# EasyEDA Pro project ProPrj_STM32电赛单片机开发板_2026-03-28.epro, board PCB1
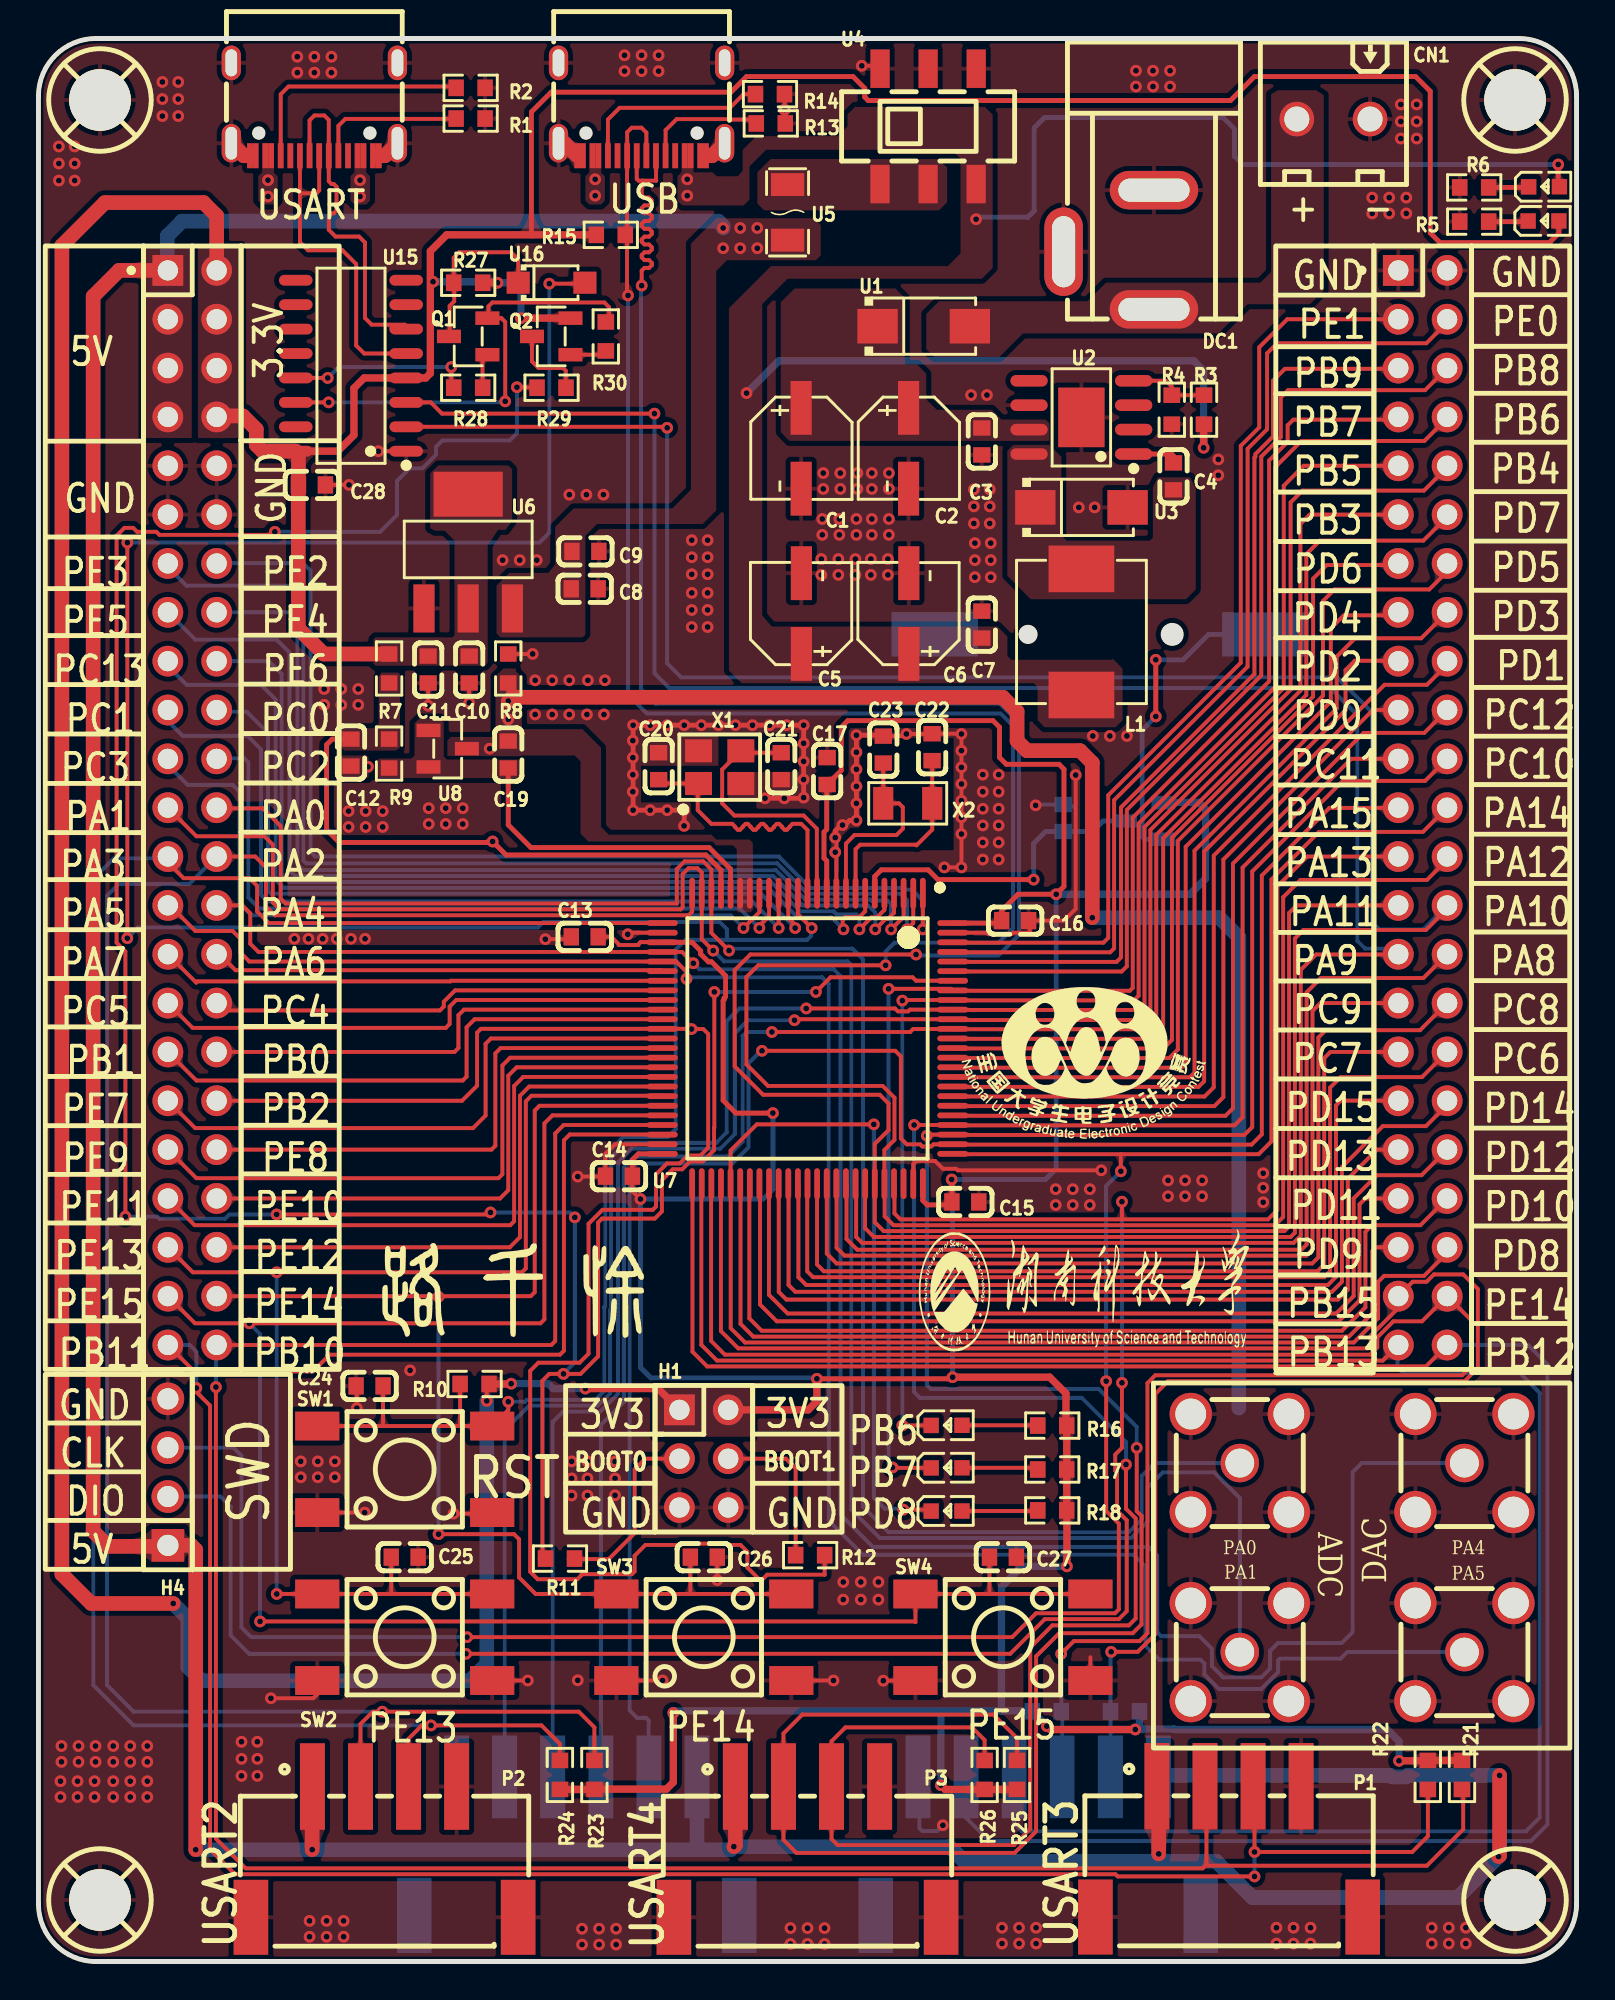
[diagram p3: board, top side]
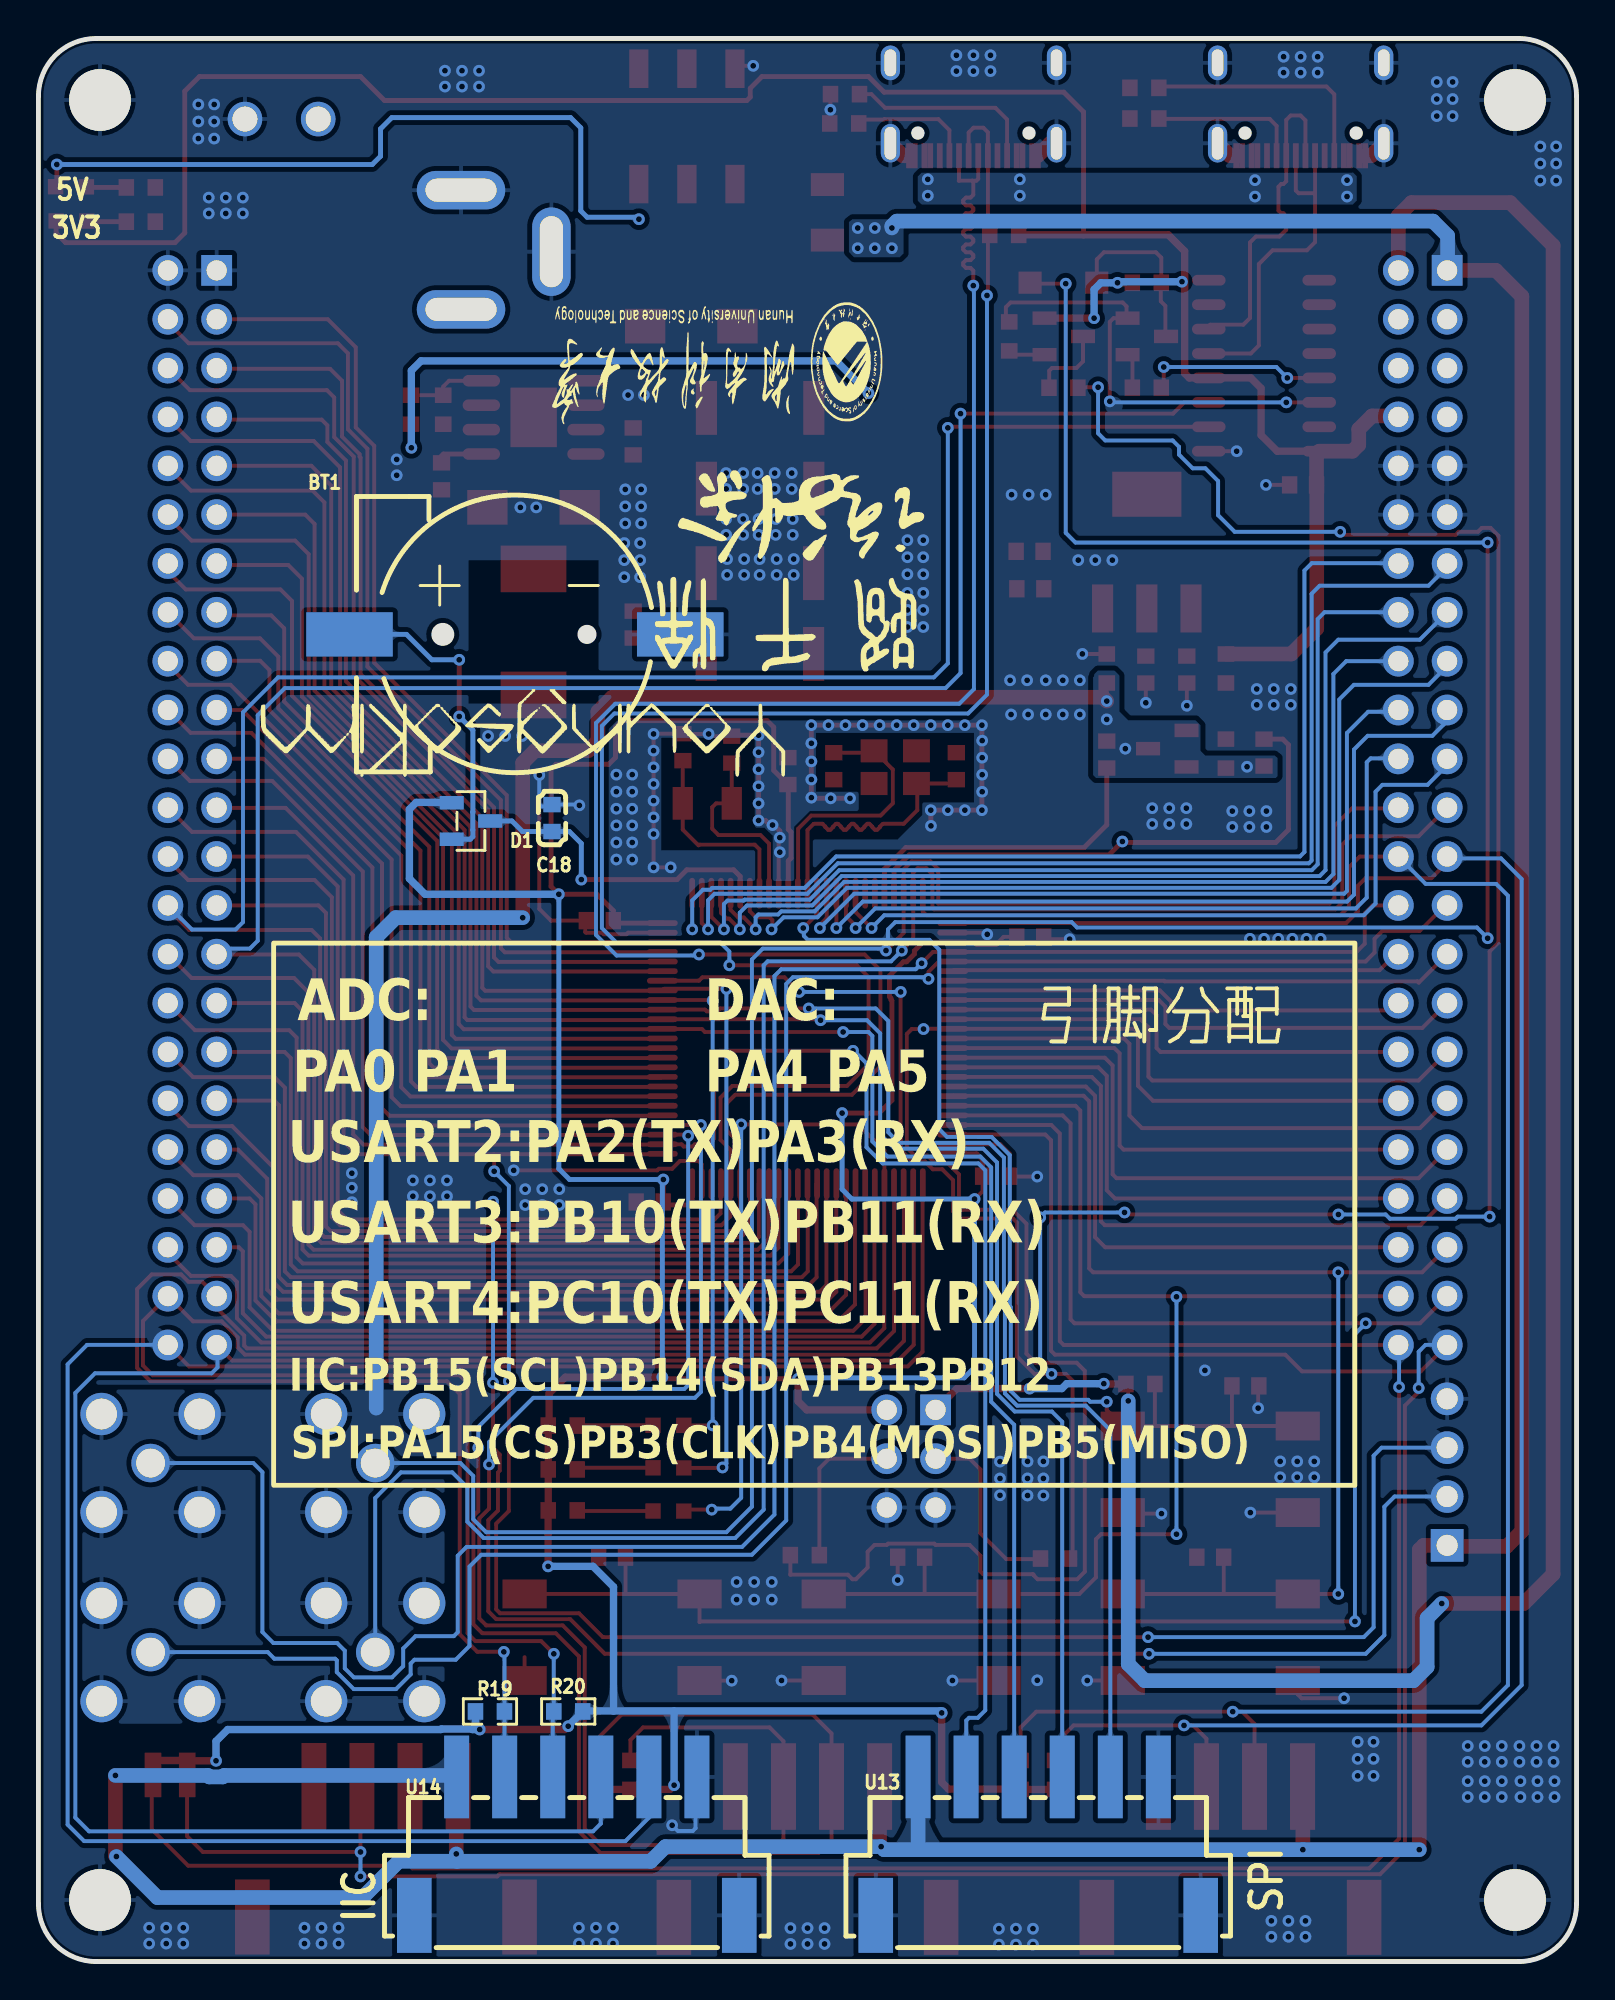
[diagram p4: board, bottom side, seen from below]

Outline 80 x 100 mm; copper layers: Top Layer, Bottom Layer. Coordinates in mm from the lower left corner of the outline.
Outline path: 0,97 0,3 arc(0.88,0.88) 3,0 77,0 arc(79.12,0.88) 80,3 80,97 arc(79.12,99.12) 77,100 3,100 arc(0.88,99.12) 0,97
Stack: Top Layer 0.035mm / Dielectric1 1.51mm FR4 er 4.5 / Bottom Layer 0.035mm

## Design rules (mm)
net OSCH2: DP1
net OSCH1: DP1
net OSCL1: DP2
net OSCL2: DP2
net PA12: DP4
net PA11: DP4
net DP: DP3
net DN: DP3
template: 自定义配置
spacing copperThickness1oz (default): track to track 0.102, other pairs 0.152 to 0.3
spacing copperThickness2oz: track to track 0.203, other pairs 0.152 to 0.3
track width copperThickness1oz (default): min 0.127, default 0.203, max 2.54
track width copperThickness2oz: min 0.203, default 0.254, max 2.54
differential pair differentialPair (default): width min 0.127, default 0.203, max 2.54; gap min 0.102, default 0.102
via viaSize (default): diameter min 0.5, default 0.61, max 10; hole min 0.3, default 0.305, max 6.3

## Placement (name value [footprint] x y rotation side)
BT1  CR1220-2ZX  [BAT-SMD_CR1220-2ZX]  55.22 69.01 180 bottom
C1  4.7uF  [CAP-SMD_BD5.0-L5.3-W5.3-FD]  39.67 78.69 270 top
C2  4.7uF  [CAP-SMD_BD5.0-L5.3-W5.3-FD]  45.26 78.69 270 top
C3  100nF  [C0603]  49.07 79.05 90 top
C4  10nF  [C0603]  59.03 77.23 90 top
C5  47uF  [CAP-SMD_BD5.0-L5.3-W5.3-FD]  39.68 70.1 90 top
C6  47uF  [CAP-SMD_BD5.0-L5.3-W5.3-FD]  45.27 70.1 90 top
C7  100nF  [C0603]  49.07 69.52 90 top
C8  10UF  [C0603]  28.41 71.38 180 top
C9  100nF  [C0603]  28.45 73.33 180 top
C10  10UF  [C0603]  22.4 67.18 90 top
C11  100nF  [C0603]  20.27 67.18 90 top
C12  100nF  [C0603]  16.26 62.87 270 top
C13  100nF  [C0603]  28.41 53.28 0 top
C14  100nF  [C0603]  30.19 40.84 0 top
C15  100nF  [C0603]  48.21 39.5 180 top
C16  100nF  [C0603]  50.8 54.13 180 top
C17  100nF  [C0603]  41.02 61.9 270 top
C18  100nF  [C0603]  53.29 59.46 90 bottom
C19  10uF  [C0603]  24.44 62.76 270 top
C20  20pF  [C0603]  32.26 62.16 90 top
C21  20pF  [C0603]  38.63 62.16 90 top
C22  10pF  [C0603]  46.48 63.15 270 top
C23  10pF  [C0603]  43.94 63.02 270 top
C24  100nF  [C0603]  17.22 29.93 0 top
C25  100nF  [C0603]  19.05 21.03 180 top
C26  100nF  [C0603]  34.61 21.03 180 top
C27  100nF  [C0603]  50.16 21.03 180 top
C28  100nF  [C0603]  14.22 76.78 0 top
CN1  MX128L-3.81-02P-GN01-Cu-Y-A  [CONN-TH_2P-P3.81_MX128L-3.81-GN01-02P-CU-Y-A]  67.35 95.81 180 top
D1  BAT54C  [SOT-23-3_L2.9-W1.3-P1.90-LS2.4-BR]  57.51 59.31 0 bottom
DC1  -  [DC-005_2.5]  57.7 89.14 90 top
H1  -  [HDR-TH_6P-P2.54-V-R2-C3-S2.54_A2541WV-2X3P]  34.61 26.15 270 top
H2  X6521WV-2x23H-C60D30  [HDR-TH_46P-2.54-V-M-R2-C23-S2.54]  8 60 270 top
H3  X6521WV-2x23H-C60D30  [HDR-TH_46P-2.54-V-M-R2-C23-S2.54]  72 60 270 top
H4  -  [HDR-TH_4P-P2.54-V-M]  6.73 25.45 90 top
L1  15uH  [IND-SMD_L7.3-W6.6]  54.25 69.14 90 top
LED1  -  [LED_0603]  78.33 90.52 0 top
LED2  -  [LED_0603]  78.36 92.3 0 top
LED3  -  [LED_0603]  47.28 27.89 0 top
LED4  -  [LED_0603]  47.28 25.68 0 top
LED5  -  [LED_0603]  47.28 23.43 0 top
P1  -  [CONN-SMD_XH2.54-4PSMD]  61.93 5.72 0 top
P2  -  [CONN-SMD_XH2.54-4PSMD]  18 5.7 0 top
P3  -  [CONN-SMD_XH2.54-4PSMD]  40 5.7 0 top
Q1  S8050  [SOT-23-3_L2.9-W1.3-P1.90-LS2.4-BR]  22.35 84.51 0 top
Q2  S8550  [SOT-23-3_L2.9-W1.3-P1.90-LS2.4-BR]  26.67 84.51 0 top
R1  5.1K  [R0603]  22.48 95.84 0 top
R2  5.1K  [R0603]  22.48 97.43 0 top
R3  10K  [R0603]  60.62 80.7 90 top
R4  3.16K  [R0603]  58.95 80.7 270 top
R5  2K  [R0603]  74.68 90.47 0 top
R6  5K  [R0603]  74.68 92.25 0 top
R7  0  [R0603]  18.24 67.24 270 top
R8  0  [R0603]  24.44 67.24 270 top
R9  1K  [R0603]  18.24 62.81 270 top
R10  10K  [R0603]  22.68 30.03 0 top
R11  10K  [R0603]  27.13 20.96 0 top
R12  10K  [R0603]  40.14 21.13 0 top
R13  5.1K  [R0603]  38.09 95.58 0 top
R14  5.1K  [R0603]  38.05 97.1 0 top
R15  10K  [R0603]  29.77 89.79 180 top
R16  2K  [R0603]  52.73 27.87 180 top
R17  2K  [R0603]  52.73 25.59 180 top
R18  2K  [R0603]  52.73 23.46 180 top
R19  4.7K  [R0603]  56.51 13 0 bottom
R20  4.7K  [R0603]  52.44 13 180 bottom
R21  4.7K  [R0603]  74.04 9.7 90 top
R22  4.7K  [R0603]  72.26 9.7 90 top
R23  4.7K  [R0603]  28.92 9.7 270 top
R24  4.7K  [R0603]  27.12 9.7 270 top
R25  4.7K  [R0603]  50.9 9.7 270 top
R26  4.7K  [R0603]  49.21 9.7 270 top
R27  10K  [R0603]  22.35 87.3 0 top
R28  1K  [R0603]  22.35 81.84 0 top
R29  1K  [R0603]  26.69 81.84 0 top
R30  1K  [R0603]  29.51 84.51 270 top
SCREW1  -  [M3螺丝]  3.2 96.8 0 top
SCREW2  -  [M3螺丝]  76.8 96.8 0 top
SCREW3  -  [M3螺丝]  3.2 3.2 0 top
SCREW4  -  [M3螺丝]  76.8 3.2 0 top
SW1  -  [SW-SMD_4P-L6.0-W6.0-P4.50-LS9.0-2]  19.05 25.6 0 top
SW2  -  [SW-SMD_4P-L6.0-W6.0-P4.50-LS9.0-2]  19.05 16.86 0 top
SW3  -  [SW-SMD_4P-L6.0-W6.0-P4.50-LS9.0-2]  34.61 16.86 0 top
SW4  -  [SW-SMD_4P-L6.0-W6.0-P4.50-LS9.0-2]  50.16 16.86 0 top
U1  SS54  [SMA_L4.2-W2.6-LS5.1-RD]  46.04 85.04 0 top
U2  TPS5450QDDARQ1  [SOIC-8_L4.9-W3.9-P1.27-LS6.0-BL-EP]  54.24 80.3 90 top
U3  SS54  [SMA_L4.2-W2.6-LS5.1-RD]  54.25 75.62 0 top
U4  YSSP2AG00  [SW-SMD_YSSP2AG00]  46.27 95.43 0 top
U5  JK-nSMD005/60V  [F1206]  38.96 90.96 270 top
U6  AMS1117-3.3  [SOT-223-3_L6.5-W3.4-P2.30-LS7.0-BR]  22.35 73.33 270 top
U7  STM32F103VET6  [LQFP-100_L14.0-W14.0-P0.50-LS16.0-BL]  40 48 180 top
U8  TL431  [SOT-23-3_L2.9-W1.3-P1.90-LS2.4-BR]  21.28 63.07 180 top
U9  6GHz  [SMA-TH_HL-SMA-KHD2]  62.48 25.92 0 top
U10  6GHz  [SMA-TH_HL-SMA-KHD2]  62.48 16.09 0 top
U11  6GHz  [SMA-TH_HL-SMA-KHD2]  74.17 25.92 0 top
U12  6GHz  [SMA-TH_HL-SMA-KHD2]  74.17 16.09 0 top
U13  XH2.54mm-LI-6P  [CONN-SMD_6P-P2.50-H]  28 6 180 bottom
U14  XH2.54mm-LI-6P  [CONN-SMD_6P-P2.50-H]  52 6 180 bottom
U15  CH340C  [SOP-16_L10.0-W3.9-P1.27-LS6.0-BL]  16.26 82.98 90 top
U16  1N4007W  [SOD-123FL_L2.7-W1.8-LS3.7-RD]  26.69 87.3 0 top
USB1  HC-TYPE-C-16P-01B  [USB-C-SMD_KH-TYPE-C-16P]  14.35 96.32 180 top
USB2  HC-TYPE-C-16P-01B  [USB-C-SMD_KH-TYPE-C-16P]  31.37 96.32 180 top
X1  8MHz  [CRYSTAL-SMD_4P-L3.2-W2.5-BL_SIT8008BI]  35.43 62.11 0 top
X2  -  [OSC-SMD_L3.2-W1.5]  45.21 60.23 0 top

## Footprints (pads in the part's own frame, mm; a bottom-side part is the same pattern mirrored in y, then rotated)
BAT-SMD_CR1220-2ZX
  rect 4.5x2.3 smd: 1(-8.6,0) 2(8.6,0)
C0603
  rect 0.8x0.9 smd: 1(-0.7,0) 2(0.7,0)
CAP-SMD_BD5.0-L5.3-W5.3-FD
  rect 2.8x1.1 smd: 1(-2.1,0) 2(2.1,0)
CONN-SMD_6P-P2.50-H
  rect 1.3x4.3 smd: 1(-6.25,3.6) 2(-3.751,3.6) 3(-1.25,3.6) 4(1.25,3.6) 5(3.75,3.6) 6(6.25,3.6)
  rect 1.8x3.9 smd: 7(-8.45,-3.6) 8(8.45,-3.6)
CONN-SMD_XH2.54-4PSMD
  rect 1.3x4.5 smd: 1(-3.75,3.4) 2(-1.25,3.4) 3(1.25,3.4) 4(3.75,3.4)
  rect 1.8x3.9 smd: 5(-6.95,-3.4) 6(6.95,-3.4)
CONN-TH_2P-P3.81_MX128L-3.81-GN01-02P-CU-Y-A
  round 1.8 hole 1.3: 1(-1.905,0) 2(1.905,0)
CRYSTAL-SMD_4P-L3.2-W2.5-BL_SIT8008BI
  rect 1.4x1.2 smd: 1(-1.1,-0.85) 2(1.1,-0.85) 3(1.1,0.85) 4(-1.1,0.85)
DC-005_2.5
  oval 2x4.6 hole 1.2x3.7: 1(-3.227,-0.318) 2(2.973,-0.318)
  oval 4.6x2 hole 3.7x1.2: 3(-0.227,4.382)
F1206
  rect 1.19x1.728 smd: 1(-1.445,0) 2(1.445,0)
HDR-TH_4P-P2.54-V-M
  rect 1.7x1.7 hole 1.1: 1(-3.81,0)
  round 1.7 hole 1.1: 2(-1.27,0) 3(1.27,0) 4(3.81,0)
HDR-TH_6P-P2.54-V-R2-C3-S2.54_A2541WV-2X3P
  rect 1.6x1.6 hole 1.05: 1(-2.54,-1.27)
  round 1.6 hole 1.05: 2(-2.54,1.27) 3(0,-1.27) 4(0,1.27) 5(2.54,-1.27) 6(2.54,1.27)
HDR-TH_46P-2.54-V-M-R2-C23-S2.54
  rect 1.6x1.6 hole 1.05: 1(-27.94,-1.27)
  round 1.6 hole 1.05: 2(-27.94,1.27) 3(-25.4,-1.27) 4(-25.4,1.27) 5(-22.86,-1.27) 6(-22.86,1.27) 7(-20.32,-1.27) 8(-20.32,1.27) 9(-17.78,-1.27) 10(-17.78,1.27) 11(-15.24,-1.27) 12(-15.24,1.27) 13(-12.7,-1.27) 14(-12.7,1.27) 15(-10.16,-1.27) 16(-10.16,1.27) 17(-7.62,-1.27) 18(-7.62,1.27) 19(-5.08,-1.27) 20(-5.08,1.27) 21(-2.54,-1.27) 22(-2.54,1.27) 23(0,-1.27) 24(0,1.27) 25(2.54,-1.27) 26(2.54,1.27) 27(5.08,-1.27) 28(5.08,1.27) 29(7.62,-1.27) 30(7.62,1.27) 31(10.16,-1.27) 32(10.16,1.27) 33(12.7,-1.27) 34(12.7,1.27) 35(15.24,-1.27) 36(15.24,1.27) 37(17.78,-1.27) 38(17.78,1.27) 39(20.32,-1.27) 40(20.32,1.27) 41(22.86,-1.27) 42(22.86,1.27) 43(25.4,-1.27) 44(25.4,1.27) 45(27.94,-1.27) 46(27.94,1.27)
IND-SMD_L7.3-W6.6
  rect 2.424x3.42 smd: 1(3.278,0) 2(-3.278,0)
LED_0603
  rect 0.8x0.8 smd: 1(-0.851,-0.01) 2(0.75,-0.005)
LQFP-100_L14.0-W14.0-P0.50-LS16.0-BL
  oval 0.3x1.6 smd: 1(-6,-7.55) 2(-5.5,-7.55) 3(-5,-7.55) 4(-4.5,-7.55) 5(-4,-7.55) 6(-3.5,-7.55) 7(-3,-7.55) 8(-2.5,-7.55) 9(-2,-7.55) 10(-1.5,-7.55) 11(-1,-7.55) 12(-0.5,-7.55) 13(0,-7.55) 14(0.5,-7.55) 15(1,-7.55) 16(1.5,-7.55) 17(2,-7.55) 18(2.5,-7.55) 19(3,-7.55) 20(3.5,-7.55) 21(4,-7.55) 22(4.5,-7.55) 23(5,-7.55) 24(5.5,-7.55) 25(6,-7.55) 51(6,7.55) 52(5.5,7.55) 53(5,7.55) 54(4.5,7.55) 55(4,7.55) 56(3.5,7.55) 57(3,7.55) 58(2.5,7.55) 59(2,7.55) 60(1.5,7.55) 61(1,7.55) 62(0.5,7.55) 63(0,7.55) 64(-0.5,7.55) 65(-1,7.55) 66(-1.5,7.55) 67(-2,7.55) 68(-2.5,7.55) 69(-3,7.55) 70(-3.5,7.55) 71(-4,7.55) 72(-4.5,7.55) 73(-5,7.55) 74(-5.5,7.55) 75(-6,7.55)
  oval 1.6x0.3 smd: 26(7.55,-6) 27(7.55,-5.5) 28(7.55,-5) 29(7.55,-4.5) 30(7.55,-4) 31(7.55,-3.5) 32(7.55,-3) 33(7.55,-2.5) 34(7.55,-2) 35(7.55,-1.5) 36(7.55,-1) 37(7.55,-0.5) 38(7.55,0) 39(7.55,0.5) 40(7.55,1) 41(7.55,1.5) 42(7.55,2) 43(7.55,2.5) 44(7.55,3) 45(7.55,3.5) 46(7.55,4) 47(7.55,4.5) 48(7.55,5) 49(7.55,5.5) 50(7.55,6) 76(-7.55,6) 77(-7.55,5.5) 78(-7.55,5) 79(-7.55,4.5) 80(-7.55,4) 81(-7.55,3.5) 82(-7.55,3) 83(-7.55,2.5) 84(-7.55,2) 85(-7.55,1.5) 86(-7.55,1) 87(-7.55,0.5) 88(-7.55,0) 89(-7.55,-0.5) 90(-7.55,-1) 91(-7.55,-1.5) 92(-7.55,-2) 93(-7.55,-2.5) 94(-7.55,-3) 95(-7.55,-3.5) 96(-7.55,-4) 97(-7.55,-4.5) 98(-7.55,-5) 99(-7.55,-5.5) 100(-7.55,-6)
M3螺丝
  round 3.2 hole 3.2: 1(0,0)
OSC-SMD_L3.2-W1.5
  rect 1.05x1.7 smd: 1(-1.275,0) 2(1.275,0)
R0603
  rect 0.806x0.864 smd: 1(-0.753,0) 2(0.753,0)
SMA-TH_HL-SMA-KHD2
  round 2.2 hole 1.6: 1(-2.55,2.55) 2(2.55,2.55) 3(2.55,-2.55) 4(-2.55,-2.55)
  round 2 hole 1.5: 5(0,0)
SMA_L4.2-W2.6-LS5.1-RD
  rect 2.1x1.8 smd: 1(-2.4,0) 2(2.4,0)
SOD-123FL_L2.7-W1.8-LS3.7-RD
  rect 1.2x1.15 smd: 1(-1.735,0) 2(1.735,0)
SOIC-8_L4.9-W3.9-P1.27-LS6.0-BL-EP
  oval 0.602x1.941 smd: 1(-1.905,-2.72) 2(-0.635,-2.72) 3(0.635,-2.72) 4(1.905,-2.72) 5(1.905,2.72) 6(0.635,2.72) 7(-0.635,2.72) 8(-1.905,2.72)
  rect 3.098x2.41 smd: 9(0,0)
SOP-16_L10.0-W3.9-P1.27-LS6.0-BL
  oval 0.56x1.745 smd: 1(-4.445,-2.873) 2(-3.175,-2.873) 3(-1.905,-2.873) 4(-0.635,-2.873) 5(0.635,-2.873) 6(1.905,-2.873) 7(3.175,-2.873) 8(4.445,-2.873) 9(4.445,2.873) 10(3.175,2.873) 11(1.905,2.873) 12(0.635,2.873) 13(-0.635,2.873) 14(-1.905,2.873) 15(-3.175,2.873) 16(-4.445,2.873)
SOT-23-3_L2.9-W1.3-P1.90-LS2.4-BR
  rect 1.25x0.7 smd: 1(1,-0.95) 2(1,0.95) 3(-1,0)
SOT-223-3_L6.5-W3.4-P2.30-LS7.0-BR
  rect 2.5x1.1 smd: 1(2.97,-2.3) 2(2.97,0) 3(2.97,2.3)
  rect 2.34x3.6 smd: 4(-2.97,0)
SW-SMD_4P-L6.0-W6.0-P4.50-LS9.0-2
  rect 2.3x1.5 smd: 1(-4.55,2.25) 2(4.55,2.25) 3(-4.55,-2.25) 4(4.55,-2.25)
SW-SMD_YSSP2AG00
  rect 1x2 smd: 1(-2.5,3) 2(0,3) 3(2.5,3) 4(-2.5,-3) 5(0,-3) 6(2.5,-3)
USB-C-SMD_KH-TYPE-C-16P
  oval 1x2 hole 0.6x1.7: 1(-4.32,1.765) 2(4.32,1.765)
  oval 1x1.8 hole 0.6x1.4: 3(-4.32,-2.415) 4(4.32,-2.415)
  rect 0.3x1.3 smd: A1(-3.35,2.415) A4(-2.55,2.415) A5(-1.25,2.415) A6(-0.25,2.415) A7(0.25,2.415) A8(1.25,2.415) A9(2.55,2.415) A12(3.35,2.415) B1(3.05,2.415) B4(2.25,2.415) B5(1.75,2.415) B6(0.75,2.415) B7(-0.75,2.415) B8(-1.75,2.415) B9(-2.25,2.415) B12(-3.05,2.415)

## Nets
As in the schematic.

Pads without a net: U2 2 3 5; U7 73; U15 7 8 9 10 11 12 15; USB1 A8 B8; USB2 A8 B8

## Via types
v1: diameter 0.61, hole 0.305, Top Layer to Bottom Layer, 454 vias

## Routing (per net, layer and track width the routed paths; a pad name or vN(x,y) marks a point on that pad's centre or on a via; arc(x,y) is an arc through that point)
AGND: length 74.3
  Top Layer w0.203: R8.2 v1(24.44,65.54)
  Top Layer w0.762: v1(24.44,65.54) 24.63,65.74 50.16,65.74 50.9,65 50.9,63.47 51.41,62.97 54.18,62.97 54.81,62.33 v1(54.81,54.28)
  Bottom Layer w0.762: 62.43,28.78 62.43,53.26 61.42,54.28 v1(54.81,54.28)
  vias: v1(17.14,62.13) v1(23.47,63.07) v1(24.44,64.59)
GND: length 119.6
  Top Layer w0.203: SW2.3 14.5,13.89 14.3,13.69 v1(12.09,13.69) ; 45.62,14.61 45.61,14.6 v1(43.94,14.6) ; U15.1 v1(17.68,78.54) ; v1(41.44,58.44) 41.5,58.38 U7.10 ; U7.74 45.5,41.46 45.67,41.63 46.63,41.63 47.04,41.22 47.73,41.22 47.81,41.14 v1(55.28,41.14) ; SW1.4 23.55,23.29 v1(21.59,23.29) ; C24.1 16.56,29.9 v1(16.56,28.78) ; v1(25.71,68) 25.7,67.99 R8.1 ; U7.99 49.33,53.5 49.41,53.42 50.6,53.42 50.68,53.5 51.52,53.5 51.56,53.54 51.56,54.07 C16.1 53.34,54.13 53.95,54.74 v1(53.95,61.7) ; C11.1 v1(20.27,65.3) ; v1(26.37,53.16) 27.59,53.16 C13.1 ; SW3.3 v1(32.46,14.61) ; C28.2 v1(16.15,76.78) ; U4.1 43.62,98.58 v1(42.82,98.58) ; SW1.3 v1(16.97,23.35) ; SW2.4 v1(25.45,14.61) ; v1(38.81,96.29) 38.81,97.1 R14.2 ; SW4.4 54.72,15.82 ; U7.49 32.44,42.49 29.97,42.49 29.49,42.02 C14.1 29.47,40.82 v1(28.05,40.82) ; 47.09,56.87 v1(47.12,56.9) v1(48.01,56.9) v1(48.01,58.63) v1(48.01,59.5) v1(48.01,60.36) v1(48.01,61.23) v1(48.01,62.1) v1(48.01,62.97) v1(48.01,63.83) 47.99,63.85 C22.1 46.47,63.83 v1(45.14,63.83) 45.03,63.72 C23.1 ; 22.4,66.48 v1(22.4,65.46) ; C26.1 v1(35.31,19.84) ; SW3.4 v1(41.35,14.61) ; U7.27 30.74,53.5 v1(30.65,53.42)
  Top Layer w0.254: C23.1 43.89,63.77 v1(42.54,63.77) v1(42.54,62.88) v1(42.54,62) v1(42.54,61.11) v1(42.54,60.22) v1(42.54,59.34) 42.19,59.34 41.95,59.1 v1(41.82,59.1) 41.75,59.1 41.44,58.79 v1(41.44,58.44) ; v1(33.58,59.05) 33.59,59.06 v1(33.59,59.87) v1(32.7,59.87) v1(31.81,59.87) v1(30.93,59.87) v1(30.93,64.29) v1(31.82,64.29) v1(32.7,64.29) v1(33.59,64.29) v1(34.48,64.29) v1(35.36,64.29) v1(36.25,64.29) v1(37.14,64.29) v1(38.03,64.29) v1(38.91,64.29) v1(39.8,64.29) v1(39.8,63.35) v1(39.8,62.41) v1(39.8,61.47) v1(39.8,60.52) 39.76,60.49 v1(38.79,60.49) v1(37.79,60.49)
  Top Layer w0.762: USB1.A12 10.68,93.9 USB1.2 ; USB1.1 18.02,93.9 USB1.A1 ; USB2.2 27.37,94.55 USB2.A12 ; USB2.1 35.04,93.9 USB2.A1
  Bottom Layer w0.203: U14.6 45.82,9.53 45.82,6.93 45.97,6.79 46.74,6.79 v1(47.04,7.09) ; v1(53.95,61.7) 53.95,60.16 53.86,60.07 53.38,60.07 C18.2 51.91,60.16 v1(51.87,60.12)
  vias: v1(1.06,94.38) v1(1.06,93.5) v1(1.06,92.61) v1(1.15,9.38) v1(1.15,8.55) v1(1.2,11.21) v1(1.2,10.38) v1(1.89,94.38) v1(1.89,93.5) v1(1.89,92.61) v1(2.03,9.38) v1(2.03,8.55) v1(2.08,11.21) v1(2.08,10.38) v1(2.92,9.38) v1(2.92,8.55) v1(2.97,11.21) v1(2.97,10.38) v1(3.89,11.21) v1(3.89,10.38) v1(3.89,9.38) v1(3.89,8.55) v1(4.78,11.21) v1(4.78,10.38) v1(4.78,9.38) v1(4.78,8.55) v1(5.66,11.21) v1(5.66,10.38) v1(5.66,9.38) v1(5.66,8.55) v1(6.45,97.74) v1(6.45,96.85) v1(6.45,95.96) v1(7.27,97.74) v1(7.27,96.85) v1(7.27,95.96) v1(10.56,11.43) v1(10.56,10.54) v1(10.56,9.65) v1(11.39,11.43) v1(11.39,10.54) v1(11.39,9.65) v1(13.31,53.18) v1(13.46,99.05) v1(13.46,98.22) v1(13.64,26.01) v1(13.64,25.18) v1(14.05,53.18) v1(14.1,2.11) v1(14.1,1.29) v1(14.35,99.05) v1(14.35,98.22) v1(14.53,26.01) v1(14.53,25.18) v1(14.78,53.18) v1(14.86,66.17) v1(14.86,65.35) v1(14.99,2.11) v1(14.99,1.29) v1(15.24,99.05) v1(15.24,98.22) v1(15.42,26.01) v1(15.42,25.18) v1(15.52,53.18) v1(15.75,66.17) v1(15.75,65.35) v1(15.87,2.11) v1(15.87,1.29) v1(16.13,59.82) v1(16.13,59) v1(16.25,53.18) v1(16.63,66.17) v1(16.63,65.35) v1(17.02,59.82) v1(17.02,59) v1(16.99,53.18) v1(17.9,59.82) v1(17.9,59) v1(19.33,30.74) v1(20.3,59.98) v1(20.3,59.15) v1(21.18,59.98) v1(21.18,59.15) v1(22.07,59.98) v1(22.07,59.15) v1(24.14,72.87) v1(25.03,72.87) v1(25.83,66.62) v1(25.83,64.85) v1(25.92,72.87) v1(26.72,66.62) v1(26.72,64.85) v1(27.61,76.28) v1(27.61,66.62) v1(27.61,64.85) v1(27.73,26.01) v1(27.73,25.12) v1(27.73,24.23) v1(28.05,14.62) v1(28.27,1.71) v1(28.27,0.88) v1(28.5,76.28) v1(28.53,64.85) v1(28.58,66.62) v1(28.56,26.01) v1(28.56,25.12) v1(28.56,24.23) v1(29.16,1.71) v1(29.16,0.88) v1(29.39,76.28) v1(29.41,64.85) v1(29.46,66.62) v1(29.99,26) v1(29.99,25.12) v1(29.99,24.25) v1(30.05,1.71) v1(30.05,0.88) v1(30.48,99.13) v1(30.48,98.3) v1(30.92,63.49) v1(30.92,62.6) v1(30.92,61.72) v1(30.92,60.83) v1(31.37,99.13) v1(31.37,98.3) v1(32.26,99.13) v1(32.26,98.3) v1(33.98,73.91) v1(33.98,73.03) v1(33.98,72.14) v1(33.98,71.17) v1(33.98,70.28) v1(33.98,69.4) v1(34.8,73.91) v1(34.8,73.03) v1(34.8,72.14) v1(34.8,71.17) v1(34.8,70.28) v1(34.8,69.4) v1(39.11,1.74) v1(39.11,0.91) v1(40,1.74) v1(40,0.91) v1(40.72,72.93) v1(40.72,72.11) v1(40.82,77.4) v1(40.82,76.58) v1(40.77,75.01) v1(40.77,74.19) v1(40.89,1.74) v1(40.89,0.91) v1(41.44,57.69) v1(41.6,72.93) v1(41.6,72.11) v1(41.71,77.4) v1(41.71,76.58) v1(41.66,75.01) v1(41.66,74.19) v1(41.86,19.74) v1(41.86,18.82) v1(42.54,75.01) v1(42.54,74.19) v1(42.49,72.93) v1(42.49,72.11) v1(42.59,77.4) v1(42.59,76.58) v1(42.77,19.74) v1(42.77,18.82) v1(43.35,77.4) v1(43.35,76.58) v1(43.35,75.01) v1(43.35,74.19) v1(43.3,72.93) v1(43.3,72.11) v1(43.69,19.74) v1(43.69,18.82) v1(44.23,77.4) v1(44.23,76.58) v1(44.23,75.01) v1(44.23,74.19) v1(44.18,72.93) v1(44.18,72.11) v1(48.51,81.46) v1(48.65,76.55) v1(48.65,75.67) v1(48.65,74.78) v1(48.71,73.76) v1(48.71,72.87) v1(48.71,71.99) v1(49.12,61.72) v1(49.12,60.83) v1(49.12,59.95) v1(49.12,59.08) v1(49.12,58.19) v1(49.12,57.31) v1(49.33,81.46) v1(49.48,76.55) v1(49.48,75.67) v1(49.48,74.78) v1(49.53,73.76) v1(49.53,72.87) v1(49.53,71.99) v1(49.94,61.72) v1(49.94,60.83) v1(49.94,59.95) v1(49.94,59.08) v1(49.94,58.19) v1(49.94,57.31) v1(50.12,1.76) v1(50.12,0.93) v1(51,1.76) v1(51,0.93) v1(51.89,1.76) v1(51.89,0.93) v1(52.91,40.16) v1(52.91,39.34) v1(53.8,40.16) v1(53.8,39.34) v1(54.11,75.62) v1(54.68,40.16) v1(54.68,39.34) v1(54.84,63.73) v1(54.94,75.62) v1(55.73,63.73) v1(56.61,63.73) v1(57.08,98.32) v1(57.08,97.5) v1(57.97,98.32) v1(57.97,97.5) v1(58.75,40.62) v1(58.75,39.8) v1(58.86,98.32) v1(58.86,97.5) v1(59.64,40.62) v1(59.64,39.8) v1(60.53,40.62) v1(60.53,39.8) v1(61.37,78.11) v1(61.37,77.29) v1(63.7,40.99) v1(63.7,40.24) v1(63.7,39.48) v1(64.39,1.76) v1(64.39,0.93) v1(65.28,1.76) v1(65.28,0.93) v1(66.16,1.76) v1(66.16,0.93) v1(69.37,91.73) v1(69.37,90.9) v1(70.26,91.73) v1(70.26,90.9) v1(70.86,96.57) v1(70.86,95.68) v1(70.86,94.8) v1(71.14,91.73) v1(71.14,90.9) v1(71.68,96.57) v1(71.68,95.68) v1(71.68,94.8) v1(72.47,1.76) v1(72.47,0.93) v1(73.35,1.76) v1(73.35,0.93) v1(74.24,1.76) v1(74.24,0.93)
VCC+3.3V: length 491.9
  Top Layer w0.203: v1(23.32,29.15) 23.32,29.91 R10.2 ; 30.18,52.91 29.8,53.28 C13.2 ; 31.21,52.86 30.18,52.86 ; 31.21,52.91 31.31,53.01 32.44,53.01 U7.28 ; 31.29,39.65 30.89,40.05 C14.2
  Top Layer w0.254: v1(47.55,30.39) 47.46,30.3 v1(40.49,30.3) ; U7.28 34,53 34.44,52.55 34.44,52.39 34.85,51.99 35.01,51.99 35.74,51.26 35.74,50.18 35.66,50.1 35.66,50.02 35.61,49.96 35.61,44.78 36.27,44.12 v1(38.2,44.12) ; U7.11 41,57.23 40.86,57.38 40.86,58.73 41,58.87 41,61.18 C17.2 41.76,61.94 41.76,64.19 42.1,64.53 49.65,64.53 49.99,64.19 49.99,62.61 50.34,62.26 53.09,62.26 53.34,62 53.34,55.91 v1(52.93,55.5) 50.95,55.5 50.1,54.65 C16.2 49.97,54 U7.100 ; 25.64,89.79 25.64,96.18 26.67,97.21 36.02,97.21 36.83,98.02 42.37,98.02 42.98,97.41 42.98,96.95 43.16,96.77 62,96.77 63.25,98.02 71.63,98.02 72.39,97.26 72.39,89.89 72.9,89.38 78.59,89.38 79.08,89.88 LED1.2 ; U7.75 46,39.57 46.23,39.34 47.2,39.34 47.43,39.57 ; v1(47.5,40.67) 47.5,39.51 C15.2 ; U7.50 31.21,42 30.89,41.69 C14.2
  Top Layer w0.381: v1(52.45,12.24) 52.62,12.06 v1(57.05,12.06) ; H1.2 40.04,28.69 40.49,29.13 v1(40.49,30.3) ; R27.2 v1(23.88,87.3) ; v1(46.94,9.17) 47.16,8.95 R26.2 R25.2 ; v1(70.76,10.44) 72.25,10.44 R22.2 R21.2 ; R15.2 21.23,89.79 20.38,88.94 20.38,82.59 20.14,82.35 U15.4 16.94,82.35 16.41,81.81 16.41,79.38 15.57,78.54 U15.16 ; R10.2 24.57,30.03 v1(24.59,30.05) ; v1(28.45,29.79) 32.23,29.79 H1.1 ; v1(53.49,20.55) 53.49,23.45 R18.1 R17.1 R16.1 53.44,27.91 53.44,29.54 52.6,30.39 v1(47.55,30.39) ; v1(33.02,12.93) 33.02,9.32 32.66,8.97 28.93,8.97 R23.2 R24.2 ; Q2.2 v1(25.09,85.46)
  Top Layer w0.762: v1(7.01,18.62) 2.74,18.62 1.22,20.14 1.22,89.23 3.45,91.47 8.58,91.47 9.27,90.78 H2.2 ; R7.1 14.84,67.99 13.51,69.32 13.51,76.77 C28.1 13.52,78.4 U15.16 11.66,78.54 11.33,78.87 11.33,79.68 10.64,80.37 9.32,80.37 H2.8
  Bottom Layer w0.254: v1(52.93,55.5) 52.93,41.22 52.38,40.67 v1(47.5,40.67) 47.55,40.61 v1(47.55,30.39) ; v1(38.2,44.12) 38.2,40.16 37.69,39.65 v1(31.31,39.65) 31.31,30.89 31.85,30.35 40.44,30.35 v1(40.49,30.3)
  Bottom Layer w0.381: R19.2 57.27,12.28 v1(57.05,12.06) 57.43,12.06 57.46,12.09 59.04,12.09 59.07,12.06 70.16,12.06 70.76,11.46 v1(70.76,10.44) ; 50.09,13.03 50.09,19.48 51.16,20.55 v1(53.49,20.55) ; 50.09,13.03 46.94,13.03 ; 50.09,13.03 51.67,13.03 R20.2 52.45,12.25 v1(52.45,12.24) ; v1(52.93,55.5) 59.89,55.5 60.71,56.31 60.71,59.92 60.35,60.27 58.52,60.27 D1.1 ; v1(25.09,85.46) 25.09,86.94 24.74,87.3 v1(23.88,87.3) 23.82,87.35 v1(20.52,87.35) ; v1(33.02,12.93) 33.12,13.03 46.94,13.03 ; 46.94,13.03 v1(46.94,9.17) ; v1(28.45,29.79) 26.77,29.79 26.52,30.05 v1(24.59,30.05)
  Bottom Layer w0.762: v1(7.01,18.62) 7.77,17.86 7.77,15.32 8.48,14.6 22.45,14.6 23.32,15.47 v1(23.32,29.15)
VCC+5V: length 227.3
  Top Layer w0.762: v1(58.27,5.6) 58.27,9.08 58.25,9.1 ; v1(75.95,5.46) 76,5.51 v1(76,9.68) ; v1(8.18,5.82) 8.18,21.41 7.95,21.64 H4.1 6.68,21.59 3.63,21.59 2.84,22.38 2.84,86.59 4.2,87.94 H2.1 ; v1(36.17,5.97) 36.25,6.05 P3.1 ; P2.1 14.24,9.09 v1(14.24,5.82)
  Bottom Layer w0.762: 34.17,5.82 36.01,5.82 v1(36.17,5.97) 47.39,5.97 48.15,5.21 58.23,5.21 ; 34.17,5.82 34.25,5.89 U13.1 ; 34.17,5.82 v1(14.24,5.82) v1(8.18,5.82) ; 58.23,5.21 58.27,5.25 v1(58.27,5.6) ; 58.23,5.21 61.26,5.21 63.14,3.33 73.81,3.33 v1(75.95,5.46) ; v1(35.61,90.14) 35.61,90.25 35.36,90.5 7.47,90.5 6.71,89.74 6.71,87.96 H2.1 ; U14.1 58.33,9.68 70.34,9.68 70.42,9.6 71.11,9.6 71.19,9.68 v1(76,9.68)
  vias: v1(35.61,89.09) v1(36.5,90.14) v1(36.5,89.09) v1(37.39,90.14) v1(37.39,89.09)
VCCA+3.3V: length 28.4
  Top Layer w0.254: U7.22 35.5,56.76 34.72,57.54 24.32,57.54 v1(23.62,58.24) 23.57,58.19 15.65,58.19 14.99,58.85 14.99,63.27 15.28,63.57 C12.1
BOOT0: length 145
  Top Layer w0.203: v1(12.29,74.35) 12.13,74.19 6.29,74.19 6.13,74.35 5.13,74.35 4.93,74.55 4.47,74.55 4.06,74.14 4.06,52.98 4.52,52.53 v1(4.52,38.73) ; U7.94 47.55,51 45.64,51 45.47,51.18 41.2,51.18 v1(40.44,50.42) ; v1(12.39,38.85) 23.41,38.85 v1(23.51,38.95) ; v1(24.89,81.86) 25.91,81.86 R29.1 ; 26.07,20.93 26.21,21.07 26.21,30.2 26.57,30.56 v1(27.31,30.56) 28.19,30.56 29.11,31.47 29.11,38.43 29.31,38.63 32.06,38.63 32.43,39 32.43,40.63 32.99,41.2 33.48,41.2 33.89,41.61 34.55,41.61 35.14,42.19 35.14,43.34 35.15,43.36 v1(35.15,50.42)
  Bottom Layer w0.203: v1(35.15,50.42) v1(40.44,50.42) ; v1(27.31,30.56) 27.9,31.15 v1(27.9,38.7) 27.64,38.95 v1(23.51,38.95) ; v1(4.52,38.73) 6.19,38.73 6.29,38.63 9.71,38.63 9.93,38.85 v1(12.39,38.85) ; v1(24.89,81.86) 24.89,79.47 24.51,79.1 21.01,79.1 20.68,78.77 20.68,78.36 19.96,77.65 19.3,77.65 18.64,76.99 18.64,75.21 17.78,74.35 v1(12.29,74.35)
BOOT1: length 83.3
  Top Layer w0.203: R12.2 40.89,20.12 40.89,20.12 37.9,20.12 37.66,19.88 37.49,19.88 36.87,20.49 36.87,21.31 36.52,21.66 35.88,21.66 35.81,21.73 33.4,21.73 33.34,21.66 31.57,21.66 31.01,21.1 31.01,20.29 30.86,20.14 28.27,20.14 28.24,20.11 28.24,20.08 28.03,19.88 25.97,19.88 25.58,20.27 25.58,30.71 26,31.14 28.14,31.14 28.61,31.61 28.61,38.36 29.34,39.09 31.95,39.09 32.12,39.26 32.12,40.93 32.69,41.5 33.35,41.5 33.76,41.91 34.43,41.91 34.83,42.32 34.83,48.23 34.58,48.49 v1(33.97,48.49) 33.96,48.5 U7.37 23.01,48.5 22.81,48.3 22.81,45.54 22.03,44.76 H2.36
CC11: length 6.4
  Top Layer w0.203: R13.1 37.13,95.78 36.02,95.78 36,95.81 33.19,95.81 32.62,95.23 USB2.A5
CC12: length 10.1
  Top Layer w0.203: R14.1 36.68,97.1 35.97,96.39 30.23,96.39 29.62,95.79 USB2.B5
CC21: length 7.8
  Top Layer w0.203: USB1.A5 15.6,95.46 15.96,95.82 21.71,95.82 R1.1
CC22: length 12.5
  Top Layer w0.203: R2.1 21.66,97.5 13,97.5 12.6,97.1 USB1.B5
DN: length 17.8
  Top Layer w0.203: U15.6 19.13,85.04 19.05,85.12 17.33,85.12 16.98,85.47 16.98,89.39 16.68,89.7 15.45,89.7 15.1,90.05 15.1,90.76 15.24,90.91 15.36,90.91 15.5,91.05 15.5,92.29 15.36,92.43 15.24,92.43 15.1,92.58 USB1.B7 15.1,95.76 14.87,96 14.36,96 14.1,95.74 USB1.A7
DP: length 17.8
  Top Layer w0.203: USB1.A6 14.6,92.09 14.46,91.95 13.64,91.95 13.6,92 ; 13.6,92 USB1.B6 ; 13.6,92 13.6,89.41 14.03,88.98 15.81,88.98 16.52,88.27 16.52,84.04 16.94,83.62 U15.5
DTR: length 9.5
  Top Layer w0.203: U15.13 v1(15.05,82.35) ; R28.1 21.47,81.97 v1(21.47,82.92)
  Bottom Layer w0.203: v1(21.47,82.92) 15.61,82.92 v1(15.05,82.35)
FB: length 4.2
  Top Layer w0.203: R3.2 R4.1 58.95,81.9 58.64,82.2 U2.4
OSCH1: length 14.1
  Top Layer w0.203: 39.8,59.59 40.49,58.9 40.49,55.56 U7.12 ; 39.8,59.59 36.19,59.59 35.56,60.23 35.56,61.98 X1.3 36.63,62.86 C21.2
OSCH2: length 14.1
  Top Layer w0.203: C20.1 32.46,61.26 X1.1 34.29,61.21 34.29,59.87 35,59.16 36.08,59.16 36.23,59.02 36.23,59 36.37,58.85 36.49,58.85 36.63,59 36.63,59.02 36.78,59.16 36.9,59.16 37.04,59.02 37.04,59 37.18,58.85 37.3,58.85 37.45,59 37.45,59.02 37.59,59.16 37.71,59.16 37.85,59.02 37.85,59 38,58.85 38.12,58.85 38.26,59 38.26,59.02 38.4,59.16 38.52,59.16 38.67,59.02 38.67,59 38.81,58.85 38.93,58.85 39.07,59 39.07,59.02 39.22,59.16 39.68,59.16 40,58.83 U7.13
OSCL1: length 10.3
  Top Layer w0.203: U7.8 42.5,57.84 42.74,58.08 45.63,58.08 45.67,58.04 46.49,58.86 X2.2 46.49,62.44 C22.2
OSCL2: length 10.2
  Top Layer w0.203: C23.2 43.94,60.23 X2.1 44.75,60.23 44.96,60.02 44.96,58.91 44.63,58.58 42.44,58.58 42,58.13 U7.9
PA0: length 95.4
  Top Layer w0.203: H2.24 9.31,59.96 11.68,59.96 12.6,59.05 12.6,55.27 12.85,55.02 33.2,55.02 ; 33.2,55.02 33.2,56.8 33.61,57.21 34.58,57.21 35,56.79 U7.23 35,53.49 v1(35.92,52.57)
  Bottom Layer w0.203: v1(35.92,52.57) 36.02,52.67 42.33,52.67 42.89,52.11 42.89,23.65 44.22,22.33 56.71,22.33 57.39,23 57.39,25.25 58.06,25.92 U9.5
PA1: length 105.7
  Top Layer w0.203: H2.23 8.22,58.51 11.75,58.51 12.19,58.08 12.19,55.07 12.55,54.71 33.41,54.71 33.51,54.81 33.51,56.55 33.81,56.85 34.27,56.85 34.5,56.63 U7.24 34.5,53.17 v1(35.1,52.57)
  Bottom Layer w0.203: v1(35.1,52.57) 35.65,52.01 42.08,52.01 42.28,51.81 42.28,23.5 43.76,22.02 56.84,22.02 57.69,22.87 57.69,24.65 58.48,25.44 61.15,25.44 61.67,24.92 61.67,24.92 62.48,24.1 U10.5
PA2: length 108.5
  Top Layer w0.203: H2.26 11.28,57.46 11.83,56.9 11.83,54.86 12.29,54.41 33.81,54.41 34,54.59 U7.25 ; R23.1 28.92,12.18 28.1,12.99 v1(17.88,12.99) 17.39,12.99 16.75,12.35 P2.2
  Bottom Layer w0.203: v1(17.88,12.99) 4.95,12.99 3.57,14.37 3.57,55.43 4.18,56.04 7.85,56.04 H2.26
PA3: length 104.7
  Top Layer w0.203: P2.3 19.25,11.59 19.94,12.28 v1(20.42,12.28) 26.16,12.28 27.12,11.32 R24.1 ; U7.26 11.98,54 11.37,54.61 11.37,55.94 10.97,56.33 7.55,56.33 6.73,57.15 H2.25
  Bottom Layer w0.203: v1(20.42,12.28) 4.95,12.28 2.86,14.37 2.86,56.29 3.93,57.36 6.63,57.36 H2.25
PA4: length 111.7
  Top Layer w0.203: v1(34.06,51.91) 33.47,52.5 U7.29 11.44,52.5 11.02,52.93 11.02,54.51 10.6,54.92 H2.28
  Bottom Layer w0.203: v1(34.06,51.91) 34.37,51.6 41.36,51.6 41.72,51.24 41.72,23.24 43.4,21.56 57.73,21.56 58.19,21.1 58.19,17.12 58.4,16.92 60.39,16.92 61.03,16.28 61.03,15.36 61.61,14.78 63.6,14.78 64.07,15.25 64.07,16.16 64.47,16.56 67.78,16.56 68.35,17.13 68.35,25.45 68.83,25.92 U11.5
PA5: length 105.3
  Top Layer w0.203: v1(33.71,51.1) 33.71,51.46 33.17,52 U7.30 10.97,52 10.51,52.47 10.51,53.18 10.1,53.59 8.16,53.59 6.93,54.82 6.83,54.82 H2.27
  Bottom Layer w0.203: U12.5 68.07,16.09 67.73,15.75 64.57,15.75 64.48,15.66 64.48,15.05 63.6,14.17 61.41,14.17 60.64,14.93 60.64,15.5 60.44,15.69 58.29,15.69 57.58,16.41 57.58,20.54 56.97,21.15 42.89,21.15 41.11,22.94 41.11,50.84 40.76,51.18 33.79,51.18 v1(33.71,51.1)
PA6: length 23.5
  Top Layer w0.203: H2.30 9.42,52.38 10.25,51.55 32.4,51.55 U7.31
PA7: length 26.4
  Top Layer w0.203: H2.29 8.21,50.9 8.27,50.97 21.43,50.97 21.46,51 U7.32
PA8: length 48.4
  Top Layer w0.203: H3.30 72.03,51.14 66.7,51.14 65.96,50.4 65.96,37.29 65.69,37.01 42.59,37.01 42.03,37.57 42.03,40.43
PA9: length 123.7
  Top Layer w0.203: U15.3 20.4,81.08 20.99,80.49 v1(32.04,80.49) ; H3.29 70.72,52.37 66.45,52.37 65.66,51.57 65.66,37.75 65.28,37.37 42.84,37.37 42.53,37.68 42.53,40.43
  Bottom Layer w0.203: H3.29 70.44,52.67 69,52.67 68.6,53.08 68.6,64.81 67.19,66.22 32.82,66.22 32.04,67 v1(32.04,80.49)
PA10: length 128
  Top Layer w0.203: v1(32.7,79.75) 32.65,79.81 U15.2 ; 43.03,40.43 42.99,40.39 42.99,38.14 43.45,37.68 65.13,37.68 65.35,37.9 65.35,53.2 65.79,53.64 72.17,53.64 73.27,54.74 H3.28
  Bottom Layer w0.203: v1(32.7,79.75) 32.7,67.5 33.43,66.78 67.54,66.78 69.36,64.96 69.36,54.05 69.74,53.67 72.02,53.67 H3.28
PA11: length 144.8
  Top Layer w0.203: U7.70 43.5,42.52 44.22,43.24 44.22,44.61 43.76,45.07 37.69,45.07 36.21,46.55 36.21,51.55 37.03,52.37 v1(45.65,52.37) ; H3.27 65.44,54.92 65.05,54.53 65.05,38.22 64.8,37.98 43.96,37.98 43.5,38.44 43.5,40.4 ; USB2.B7 32.12,93.9 32.12,92.61 32.13,92.61 31.43,92.61 ; 31.43,92.61 31.38,92.55 31.38,91.87 31.52,91.73 31.76,91.73 31.9,91.58 31.9,91.46 31.76,91.32 31.52,91.32 31.38,91.18 31.38,91.06 31.52,90.91 31.76,90.91 31.9,90.77 31.9,90.65 31.76,90.51 31.52,90.51 31.38,90.36 31.38,90.24 31.52,90.1 31.76,90.1 31.9,89.96 31.9,89.84 31.76,89.69 31.52,89.69 31.38,89.55 31.38,89.43 31.52,89.29 31.76,89.29 31.9,89.14 31.9,89.03 31.76,88.88 31.52,88.88 31.38,88.74 31.38,88.62 31.52,88.47 31.76,88.47 31.9,88.33 31.9,88.21 31.76,88.07 31.52,88.07 31.38,87.92 v1(31.38,87.15) ; 31.43,92.61 31.21,92.61 31.12,92.7 USB2.A7 ; 43.53,40.43 43.53,40.43
  Bottom Layer w0.203: v1(45.65,52.37) 45.7,52.31 49.93,52.31 51,53.39 51,64.4 50,65.41 32.11,65.41 31.34,66.17 31.34,87.12 v1(31.38,87.15)
PA12: length 144.8
  Top Layer w0.203: 44.03,40.43 44.03,40.43 ; U7.71 44,42.2 44.52,42.73 44.52,44.92 43.91,45.53 37.94,45.53 36.82,46.65 36.82,51.19 37.43,51.8 v1(44.06,51.8) ; USB2.A6 31.62,95.11 31.37,95.36 30.86,95.36 30.62,95.12 USB2.B6 30.61,93.9 30.61,86.69 v1(30.66,86.64) ; 44.01,40.41 44.01,38.75 44.47,38.29 64.31,38.29 64.74,38.72 64.74,55.34 65.64,56.24 72.22,56.24 73.27,57.29 H3.26
  Bottom Layer w0.203: v1(30.66,86.64) 30.66,65.88 31.65,64.9 50.05,64.9 50.69,64.25 50.69,53.74 49.93,52.98 44.52,52.98 44.06,52.52 v1(44.06,51.8)
PA13: length 126.2
  Top Layer w0.203: 56.35,38.59 44.83,38.59 44.52,38.9 44.52,40.42 44.53,40.43 ; 56.35,38.59 63.95,38.59 64.44,39.08 64.44,55.91 65.99,57.46 H3.25 ; 56.35,38.59 56.36,38.6 v1(56.36,39.51) ; v1(22.24,16) 50.54,16 52.34,17.81 56.19,17.81 56.6,18.22 56.6,22.95 56.1,23.45 56.1,25.43 56.01,25.53 56.01,26.36 56.36,26.71 v1(56.36,30.1)
  Bottom Layer w0.203: v1(56.36,30.1) v1(56.36,39.51) ; v1(22.24,16) 10.97,16 10,16.97 10,23.65 9.47,24.18 H4.2
PA14: length 124.8
  Top Layer w0.203: v1(22.29,16.87) 50.64,16.87 51.88,18.11 55.99,18.11 56.19,18.31 56.19,22.77 55.53,23.43 v1(55.53,30.18) ; 56.32,41.98 63.46,41.98 64.13,42.65 64.13,56.27 66.6,58.74 72.01,58.74 H3.24 ; 56.32,41.98 56.3,41.96 v1(56.3,41.09) ; 56.32,41.98 47.58,41.98
  Bottom Layer w0.203: v1(22.29,16.87) 11.07,16.87 10.56,17.38 10.56,26.3 10.14,26.72 H4.3 ; v1(56.3,41.09) 55.53,40.33 v1(55.53,30.18)
PA15: length 97.1
  Top Layer w0.203: H3.23 70.72,59.99 67.15,59.99 63.63,56.47 63.63,43.01 63.1,42.48 47.58,42.48 ; v1(37.63,47.36) 44.56,47.36 44.86,47.07 44.86,42.8 45.16,42.49 45.86,42.49 45.97,42.38 46.44,42.38 46.55,42.49 47.54,42.49 U7.77
  Bottom Layer w0.203: v1(37.63,47.36) 37.58,47.36 36.93,46.71 36.93,42.34 36.09,41.5 31.11,41.5 30.75,41.14 30.75,13.06 31.14,12.68 31.6,12.68 31.74,12.53 31.74,9.66 31.75,9.65 U13.2
PB0: length 25.1
  Top Layer w0.203: H2.34 21.64,47.3 21.84,47.5 21.84,49.21 22.13,49.5 U7.35
PB1: length 29.2
  Top Layer w0.203: H2.33 8.22,45.81 22.06,45.81 22.27,46.02 22.27,48.58 22.69,49 U7.36
PB3: length 100.6
  Top Layer w0.203: v1(38.15,48.34) 45.34,48.34 45.49,48.49 47.54,48.49 U7.89 ; H3.11 66.12,75.24 65.64,74.75 65.64,66.08 58.14,58.59 58.14,48.74 57.88,48.48 47.58,48.48
  Bottom Layer w0.203: v1(38.15,48.34) 36.83,48.34 36.63,48.13 36.63,42.65 35.84,41.86 31.01,41.86 30.45,41.3 30.45,29.11 29.25,27.91 U13.3
PB4: length 107.2
  Top Layer w0.203: H3.10 73.27,77.69 72.06,76.49 65.74,76.49 65.13,75.88 65.13,66.14 57.84,58.84 57.84,49.1 57.69,48.96 47.6,48.96 47.58,48.98 ; U7.90 39.37,49 v1(39.32,48.95)
  Bottom Layer w0.203: v1(39.32,48.95) 36.9,48.95 36.22,48.27 36.22,43.02 35.46,42.27 30.86,42.27 30.14,41.55 30.14,29.52 29.22,28.6 27.29,28.6 26.75,28.06 U13.4
PB5: length 107.5
  Top Layer w0.203: U7.91 45.33,49.5 45.24,49.41 44.7,49.41 44.55,49.56 v1(39.93,49.56) ; 47.58,49.48 57.35,49.48 57.53,49.66 57.53,59 64.77,66.24 64.77,76.74 65.81,77.78 H3.9
  Bottom Layer w0.203: U13.5 24.25,27.63 25.53,28.91 29.09,28.91 29.73,29.54 29.73,33.9 29.78,33.95 29.78,41.81 30.55,42.57 35.25,42.57 35.8,43.12 35.8,48.91 36.45,49.56 v1(39.93,49.56)
PB6: length 76.5
  Top Layer w0.203: 47.58,49.98 56.98,49.98 57.22,50.22 57.22,59.18 64.31,66.27 64.31,77.7 65.68,79.07 72.09,79.07 73.27,80.25 H3.8 ; v1(44.93,49.97) 44.96,50 U7.92 ; LED3.1 v1(44.93,27.88)
  Bottom Layer w0.203: v1(44.93,27.88) v1(44.93,49.97)
PB7: length 78.3
  Top Layer w0.203: H3.7 70.59,80.18 65.27,80.18 64.97,79.88 64.97,79.02 64.01,78.05 64.01,66.57 56.92,59.48 56.92,50.63 56.77,50.48 47.58,50.48 ; v1(44.22,50.58) 47.47,50.58 U7.93 ; LED4.1 44.44,25.67 v1(44.42,25.69)
  Bottom Layer w0.203: v1(44.42,25.69) 44.22,25.9 v1(44.22,50.58)
PB8: length 51.3
  Top Layer w0.203: 56.61,59.89 63.6,66.88 63.6,78.26 64.62,79.27 64.62,81.33 65,81.71 72.12,81.71 H3.6 ; 56.61,59.89 56.61,51.75 56.34,51.48 47.58,51.48
PB9: length 48.9
  Top Layer w0.203: 47.58,51.98 56.07,51.98 56.3,52.21 56.3,60.01 63.25,66.95 63.25,78.21 63.3,78.26 63.3,78.38 64.21,79.3 64.21,82.2 64.83,82.82 70.69,82.82 H3.5
PB10: length 132.5
  Top Layer w0.203: 60.75,5.05 60.81,4.98 72.21,4.98 74.1,6.87 74.1,8.89 R21.1 ; 60.75,5.05 60.55,4.84 10.78,4.84 9.23,6.39 v1(9.23,29.87) ; 60.75,5.05 60.75,9.1 ; U7.47 27.32,43.5 26.88,43.06 26.88,32.26 26.67,32.06 H2.46
  Bottom Layer w0.203: H2.46 9.23,32.02 v1(9.23,29.87)
PB11: length 137
  Top Layer w0.203: v1(8.21,29.82) 8.21,29.62 8.93,28.91 8.93,5.83 10.22,4.54 56.02,4.54 56.13,4.43 v1(63.25,4.43) ; H2.45 8.1,30.69 14.28,30.69 15.15,31.56 27.13,31.56 27.33,31.76 27.33,42.7 27.63,43.01 32.44,43.01 U7.48 ; 63.25,9.1 v1(63.25,5.7) 71.45,5.7 72.27,6.52 72.27,8.94 R22.1
  Bottom Layer w0.203: v1(8.21,29.82) 8.21,31.71 7.85,32.07 6.74,32.07 H2.45 ; v1(63.25,5.7) v1(63.25,4.43)
PB12: length 111.5
  Top Layer w0.203: 34.03,40.43 34.02,40.42 34.02,31.71 34.78,30.94 72.17,30.94 73.27,32.05 H3.46
  Bottom Layer w0.203: H3.46 73.28,32.07 77.47,32.07 78.48,31.05 78.48,7.12 77.62,6.26 49.47,6.26 48.25,7.48 U14.5
PB13: length 106.7
  Top Layer w0.203: 34.53,40.43 34.48,40.38 34.48,32.07 35.29,31.25 69.92,31.25 H3.45
  Bottom Layer w0.203: U14.4 50.75,7.17 51.15,6.77 77.37,6.77 78.08,7.49 78.08,29.57 77.06,30.59 70.99,30.59 70.69,30.89 70.69,32.02 H3.45
PB14: length 94.1
  Top Layer w0.203: v1(53.19,16) 53.85,16.66 57.27,16.66 57.68,17.07 57.68,30.08 58.09,30.49 74.05,30.49 74.56,31 74.56,33.31 H3.44 71.96,33.29 70.47,33.29 69.63,32.45 69.63,31.93 69.26,31.56 35.7,31.56 34.99,32.27 34.99,40.39 35.03,40.43
  Bottom Layer w0.203: U14.3 53.25,12.95 R20.1 53.2,16 v1(53.19,16)
PB15: length 93.1
  Top Layer w0.203: 35.53,40.43 35.5,40.4 35.5,32.78 36.4,31.88 69.15,31.88 69.3,32.03 69.3,32.55 70.73,33.98 H3.43 71.48,35.35 72.2,35.35 72.58,35.73 74.11,35.73 74.87,34.97 74.87,30.87 74.18,30.18 58.75,30.18 58.09,29.52 58.09,17.02 57.17,16.1 v1(55.79,16.1)
  Bottom Layer w0.203: v1(55.79,16.1) 55.76,16.07 R19.1 55.76,9.61 U14.2
PC0: length 41.3
  Top Layer w0.203: U7.15 39,54.27 39.27,54
  Bottom Layer w0.203: v1(39.36,53.74) 37.57,55.53 12.09,55.53 11.94,55.67 11.94,63.88 10.84,64.99 9.36,64.99 H2.20
PC1: length 42.9
  Top Layer w0.203: U7.16 38.5,53.84
  Bottom Layer w0.203: v1(38.5,53.74) 37.12,55.12 11.93,55.12 11.58,55.48 11.58,63.02 10.86,63.74 7.5,63.74 6.73,64.51 H2.19
PC2: length 38
  Top Layer w0.203: U7.17 38,54.36 37.49,53.84 37.43,53.84
  Bottom Layer w0.203: H2.22 9.3,62.57 10.71,62.57 10.91,62.36 10.91,55.32 11.47,54.76 36.48,54.76 v1(37.5,53.74)
PC3: length 39.3
  Top Layer w0.203: v1(36.67,53.74) 37.5,54.57 U7.18
  Bottom Layer w0.203: v1(36.67,53.74) 36.01,54.41 11.07,54.41 10.45,55.02 10.45,60.83 10.1,61.19 7.75,61.19 6.73,62.21 H2.21
PC4: length 23.9
  Top Layer w0.203: H2.32 9.65,49.46 20.88,49.46 21.08,49.66 21.08,49.91 21.67,50.5 U7.33
PC5: length 27.4
  Top Layer w0.203: H2.31 8.02,48.55 21.18,48.55 21.39,48.75 21.39,49.66 21.73,50 U7.34
PC6: length 48.4
  Top Layer w0.203: H3.34 71.96,45.99 67.73,45.99 67.18,45.44 67.18,35.89 66.88,35.59 40.29,35.59 39.98,35.89 39.98,40.39 40.03,40.43
PC7: length 45.6
  Top Layer w0.203: 40.53,40.43 40.49,40.39 40.49,36.25 40.85,35.89 66.52,35.89 66.88,36.25 66.88,46.98 67.2,47.3 H3.33
PC8: length 48.4
  Top Layer w0.203: 41.03,40.43 41,40.41 41,36.81 41.51,36.3 66.25,36.3 66.57,36.62 66.57,48.05 66.95,48.43 71.86,48.43 H3.32
PC9: length 45.4
  Top Layer w0.203: H3.31 66.68,49.84 66.27,49.43 66.27,37.03 65.94,36.71 41.92,36.71 41.51,37.12 41.51,40.42 41.53,40.43
PC10: length 127
  Top Layer w0.203: 47.58,42.98 62.72,42.98 63.13,43.39 63.13,56.68 67.84,61.39 72.12,61.39 H3.22 ; v1(57.12,26.71) 57.12,23.42 57.38,23.17 57.38,17.53 56.92,17.07 53.09,17.07 51.89,15.87 51.89,6.77 50.77,5.65 39.42,5.65 38.75,6.32 P3.2 38.75,11.86 39.73,12.84 49.67,12.84 50.9,11.62 R25.1 ; 46.21,42.98 46.23,43 U7.78
  Bottom Layer w0.203: v1(46.21,42.94) 46.21,29.98 46.41,29.77 55.15,29.77 57.12,27.8 v1(57.12,26.71)
PC11: length 117.1
  Top Layer w0.203: H3.21 68.28,62.54 62.63,56.89 62.63,43.9 62.21,43.48 47.58,43.48 ; U7.79 v1(45.54,43.5) ; R26.1 49.21,11.52 48.55,12.18 41.97,12.18 41.25,11.45 P3.3 41.25,6.37 41.57,6.06 50.75,6.06 51.58,6.9 51.58,16.33 52.73,17.48 56.71,17.48 57.07,17.84 57.07,23.04 56.56,23.55 v1(56.56,25.84)
  Bottom Layer w0.203: v1(45.54,43.5) 45.54,29.62 45.85,29.31 54.26,29.31 56.56,27.01 v1(56.56,25.84)
PC12: length 41.9
  Top Layer w0.203: 47.58,43.98 61.74,43.98 62.13,44.37 62.13,57.1 68.93,63.89 72.08,63.89 H3.20
PC13: length 49.4
  Top Layer w0.203: v1(41.87,53.67) 41.83,53.71 41.83,54.16 41.97,54.3 42.69,54.3 43,54.62 U7.7
  Bottom Layer w0.203: v1(41.87,53.67) 41.24,54.3 39.48,54.3 37.95,55.83 12.75,55.83 12.34,56.24 12.34,65.63 11.58,66.39 7.7,66.39 6.73,67.36 H2.17
PD0: length 38.9
  Top Layer w0.203: H3.19 69.41,65.08 61.63,57.3 61.63,44.95 61.16,44.48 47.58,44.48
PD1: length 42.2
  Top Layer w0.203: H3.18 73.27,67.44 72.22,66.39 70.01,66.39 61.13,57.51 61.13,45.46 60.65,44.98 47.58,44.98
PD2: length 40.6
  Top Layer w0.203: H3.17 70.71,67.64 68.47,67.64 67.98,67.16 67.98,65.07 60.63,57.72 60.63,45.78 60.33,45.48 47.58,45.48
PD3: length 44
  Top Layer w0.203: 47.58,45.98 59.89,45.98 60.13,46.22 60.13,57.77 67.53,65.16 67.53,67.86 68.48,68.81 71.92,68.81 H3.16
PD4: length 41.8
  Top Layer w0.203: H3.15 70.57,70 67.89,70 67.22,69.33 67.22,65.52 59.67,57.97 59.67,46.7 59.45,46.48 47.58,46.48
PD5: length 45.8
  Top Layer w0.203: 47.58,46.98 58.81,46.98 59.26,47.43 59.26,58.27 66.81,65.82 66.81,70.75 67.41,71.35 72.34,71.35 73.27,72.28 H3.14
PD6: length 43.3
  Top Layer w0.203: 47.58,47.48 58.51,47.48 58.96,47.93 58.96,58.44 66.3,65.78 66.3,71.91 67,72.62 70.65,72.62 H3.13
PD7: length 47.3
  Top Layer w0.203: 47.58,47.98 58.29,47.98 58.5,48.18 58.5,58.41 65.94,65.86 65.94,73.18 66.65,73.89 72.03,73.89 73.27,75.12 H3.12
PD8: length 80.8
  Top Layer w0.203: U7.55 36,42.17 37.36,43.53 v1(43.45,43.53) ; 36.01,40.41 36.01,32.93 36.75,32.19 68.41,32.19 69.68,33.45 69.68,35.34 69.99,35.65 72.07,35.65 73.27,36.85 H3.42 ; 36.03,40.43 36.03,40.43 ; v1(44.98,23.5) 46.36,23.5 LED5.1
  Bottom Layer w0.203: v1(44.98,23.5) 44.93,23.55 44.01,23.55 43.45,24.11 v1(43.45,43.53)
PD9: length 45.6
  Top Layer w0.203: 36.53,40.43 36.52,40.42 36.52,33.16 37.18,32.49 68.16,32.49 69.37,33.71 69.37,36.94 69.57,37.14 H3.41
PD10: length 48.7
  Top Layer w0.203: 37.03,40.43 36.98,40.38 36.98,33.44 37.62,32.8 67.8,32.8 69.02,34.02 69.02,37.95 69.36,38.29 71.88,38.29 H3.40
PD11: length 45.4
  Top Layer w0.203: H3.39 69.02,39.68 68.71,39.38 68.71,34.38 67.63,33.29 38.4,33.29 37.53,34.16 37.53,40.43
PD12: length 48
  Top Layer w0.203: 38.03,40.43 38,40.4 38,34.67 38.96,33.7 67.5,33.7 68.41,34.61 68.41,39.68 69.62,40.89 71.94,40.89 H3.38
PD13: length 44.6
  Top Layer w0.203: H3.37 69.62,42.22 68.1,40.7 68.1,34.94 67.59,34.42 38.9,34.42 38.51,34.82 38.51,40.41 38.53,40.43
PD14: length 47.4
  Top Layer w0.203: H3.36 73.27,44.54 72.17,43.44 69.92,43.44 67.8,41.31 67.8,35.35 67.27,34.83 39.37,34.83 39.02,35.18 39.02,40.42 39.03,40.43
PD15: length 45.4
  Top Layer w0.203: H3.35 70.72,44.77 67.73,44.77 67.49,44.52 67.49,35.6 67.07,35.18 39.93,35.18 39.53,35.59 39.53,40.43 39.53,40.43
PE0: length 52.9
  Top Layer w0.203: H3.4 73.27,85.23 72.19,84.15 64.43,84.15 63.9,83.63 63.9,79.68 62.89,78.66 62.89,67.34 55.95,60.39 55.95,52.68 55.74,52.48 47.58,52.48
PE1: length 50
  Top Layer w0.203: H3.3 64.95,85.4 63.5,83.94 63.5,79.78 62.53,78.82 62.53,67.54 55.64,60.65 55.64,53.23 55.39,52.98 47.58,52.98
PE2: length 56
  Top Layer w0.203: v1(46,53.67) 46,53.67 U7.1
  Bottom Layer w0.203: v1(46,53.67) 46,55.18 45.44,55.73 45.06,55.73 44.96,55.83 40.14,55.83 38.51,57.47 14.38,57.47 14.15,57.69 14.15,72.33 13.77,72.71 9.28,72.71 H2.14
PE3: length 57.5
  Top Layer w0.203: v1(45.17,53.67) 45.5,54 U7.2
  Bottom Layer w0.203: H2.13 6.73,72.51 7.7,71.54 13.36,71.54 13.78,71.12 13.78,57.25 13.92,57.11 38.42,57.11 40.01,55.52 44.83,55.52 45.17,55.18 v1(45.17,53.67)
PE4: length 52.3
  Top Layer w0.203: v1(44.35,53.67) 44.35,53.67 45,54.32 U7.3
  Bottom Layer w0.203: v1(44.35,53.67) 44.35,54.99 44.17,55.17 43.32,55.17 43.27,55.22 39.88,55.22 38.35,56.75 13.77,56.75 13.46,57.06 13.46,69.81 13.11,70.16 9.27,70.16 H2.16
PE5: length 53.1
  Top Layer w0.203: v1(43.52,53.67) 44.08,54.23 44.2,54.23 44.5,54.53 U7.4
  Bottom Layer w0.203: v1(43.52,53.67) 43.52,54.54 43.15,54.91 39.75,54.91 38.22,56.44 13.36,56.44 13.06,56.75 13.06,68.07 12.39,68.74 8.15,68.74 H2.15
PE6: length 48.3
  Top Layer w0.203: U7.5 44,54.69 43.61,54.29 43.32,54.29 v1(42.7,53.67)
  Bottom Layer w0.203: v1(42.7,53.67) 42.7,54.3 42.55,54.45 41.53,54.45 41.37,54.61 39.63,54.61 38.1,56.14 13.06,56.14 12.65,56.55 12.65,66.95 11.98,67.62 H2.18
PE7: length 30.4
  Top Layer w0.203: H2.35 8.15,43.34 22.6,43.34 23.26,43.99 23.26,47.72 23.53,48 U7.38
PE8: length 28.2
  Top Layer w0.203: H2.38 23.56,42.22 23.77,42.42 23.77,47.22 24.04,47.5 U7.39
PE9: length 32.2
  Top Layer w0.203: H2.37 8.22,40.73 23.93,40.73 24.13,40.94 24.13,46.59 24.53,47 U7.40
PE10: length 29.5
  Top Layer w0.203: H2.40 24.01,39.68 24.44,40.11 24.44,46.06 24.87,46.5 U7.41
PE11: length 33.6
  Top Layer w0.203: H2.39 8.12,38.29 24.54,38.29 24.74,38.49 24.74,45.53 25.21,46 U7.42
PE12: length 30.9
  Top Layer w0.203: U7.43 25.53,45.5 25.04,45.02 25.04,37.67 24.52,37.14 H2.42
PE13: length 65
  Top Layer w0.203: v1(12.39,19.11) SW2.1 18.33,19.11 ; C25.2 18.35,19.14 18.33,19.11 ; H2.41 8.03,35.84 v1(12.39,35.84) 25.15,35.84 25.35,36.04 25.35,44.73 25.64,45.02 32.43,45.02 U7.44 ; 18.33,19.11 SW2.2
  Bottom Layer w0.203: v1(12.39,19.11) v1(12.39,35.84)
PE14: length 67.9
  Top Layer w0.203: C26.2 33.91,19.11 ; 33.91,19.11 SW3.1 25.86,19.11 25,19.97 25,21.96 24.74,22.22 v1(20.81,22.22) ; 33.91,19.11 39.16,19.11 ; U7.45 26.06,44.5 25.81,44.25 25.81,34.8 25.61,34.6 H2.44
  Bottom Layer w0.203: v1(20.81,22.22) v1(20.81,34.57)
PE15: length 99.1
  Top Layer w0.203: H2.43 8.14,33.19 v1(10.97,33.19) 26.11,33.19 26.32,33.39 26.32,43.58 26.73,44 U7.46 ; 49.51,19.11 45.62,19.11 45.62,17.65 45.58,17.69 v1(11.53,17.69) ; 49.51,19.11 54.71,19.11 ; 49.51,19.11 49.47,19.16 C27.2
  Bottom Layer w0.203: v1(11.53,17.69) 11.53,32.63 v1(10.97,33.19)
RST: length 145.8
  Top Layer w0.203: v1(26.57,87.25) 28.37,87.25 U16.2 ; v1(40.22,53.74) 39.5,54.46 U7.14 ; v1(4.62,53.21) v1(4.62,73.79) ; 21.86,27.85 SW1.2 ; 21.86,27.85 21.93,27.91 R10.1 ; 21.86,27.85 17.96,27.85 ; 23.6,27.84 24.44,28.68 v1(24.44,29.11) ; C24.2 17.92,27.89 17.96,27.85 ; 17.96,27.85 SW1.1
  Bottom Layer w0.203: 35.8,53.13 39.98,53.13 40.19,53.33 40.19,53.71 v1(40.22,53.74) ; 35.8,53.13 35.81,53.14 35.81,53.67 35.44,54.05 26.26,54.05 25.98,53.77 5.18,53.77 v1(4.62,53.21) ; 35.8,53.13 33.66,53.13 33.15,52.62 33.15,43.28 32.74,42.88 30.42,42.88 29.48,41.93 29.48,34.08 29.43,34.03 29.43,29.67 28.97,29.21 25.4,29.21 25.3,29.11 v1(24.44,29.11) ; v1(26.57,87.25) 26.57,74.3 26.06,73.79 v1(4.62,73.79)
RTS: length 23.8
  Top Layer w0.203: v1(24.28,81.13) 24.28,85.26 24.08,85.46 Q1.2 ; R30.1 29.61,85.26 29.68,85.33 29.68,86.03 29.44,86.27 23.61,86.27 23.41,86.07 23.41,85.66 ; U15.14 v1(15.1,81.08)
  Bottom Layer w0.203: v1(15.1,81.08) 24.22,81.08 v1(24.28,81.13)
USB+5V: length 67.9
  Top Layer w0.254: LED2.2 79.04,92.35 v1(79.04,93.45)
  Top Layer w0.381: v1(60.6,78.72) 60.6,79.92 R3.1
  Bottom Layer w0.254: v1(79.04,93.45) 62.64,93.45 62.21,93.88 62.21,95.3 61.62,95.89 52.32,95.89 51.79,95.35 51.79,91.04 51.46,90.7 48.87,90.7 v1(48.77,90.6)
  Bottom Layer w0.381: v1(60.6,78.72) 60.6,82.73 60.1,83.24 38.51,83.24 v1(36.83,81.56)
  vias: v1(11.94,92.63) v1(11.94,91.78) v1(16.73,92.63) v1(16.73,91.78) v1(28.96,92.68) v1(28.96,91.82) v1(33.74,92.68) v1(33.74,91.82)
$1N2934: length 16.9
  Top Layer w0.254: v1(58.12,64.75) v1(58.12,67.69)
  Bottom Layer w0.254: v1(58.12,67.69) 59.54,67.69 60.86,69.01 BT1.1 ; D1.2 57.54,58.36 57.4,58.5 57.4,58.84 57.41,58.84 57.41,59.78 57.4,59.78 57.4,64.03 v1(58.12,64.75)
$1N2939: length 16.6
  Top Layer w0.254: U7.6 43.5,56.43 43.84,56.77 46.28,56.77 46.79,56.26 v1(51.76,56.26)
  Bottom Layer w0.254: D1.3 55.37,59.31 54.82,58.76 C18.1 52.39,58.76 51.76,58.14 v1(51.76,56.26)
$1N3219: length 16.7
  Top Layer w0.254: U7.21 36,56.81 34.88,57.92 25.62,57.92 24.44,59.11 C19.2
$1N4205: length 9.9
  Top Layer w0.203: H1.3 31.57,26.15 31.01,25.59 31.01,22.28 29.66,20.93 27.58,20.93
$1N4207: length 8.2
  Top Layer w0.203: R12.1 39.38,25.64 38.88,26.15 H1.4
$2N1445: length 2.5
  Top Layer w0.254: C4.2 59.03,78.29 58.93,78.39 U2.1
$2N2700: length 2.1
  Top Layer w0.254: LED2.1 77.48,92.25 R6.2
$2N2722: length 2.1
  Top Layer w0.254: R5.2 77.45,90.47 77.48,90.51
$3N1132: length 4
  Top Layer w0.203: R16.2 51.96,27.88 LED3.2
$3N1136: length 4
  Top Layer w0.203: LED4.2 51.89,25.67 R17.2
$3N1141: length 4
  Top Layer w0.203: R18.2 51.95,23.43 LED5.2
$3N3674: length 9.2
  Top Layer w0.203: 21.1,84.51 21.39,84.8 21.39,86.09 21.62,86.33 21.62,87.27 R27.1 21.6,88.6 21.88,88.88 24.58,88.88 24.95,88.51 U16.1
$3N3684: length 1.7
  Top Layer w0.203: R28.2 23.1,81.85 23.1,83.56
$3N3709: length 4.1
  Top Layer w0.203: R29.2 27.43,81.85 27.43,82.72 27.29,82.86 26.01,82.86 25.67,83.2 Q2.3
$3N3714: length 1.9
  Top Layer w0.203: R30.2 29.31,83.56 Q2.1

## Copper pours and planes (outline as drawn; the poured copper is in the pictures)
AGND on Top Layer: 58.72,29.84 77.93,29.84 77.93,12.37 58.72,12.37
AGND on Top Layer: 21.27,67.24 25.15,67.24 25.15,62.67 21.27,62.67
AGND on Top Layer: 23.77,64.08 37.19,64.08 37.19,54.56 23.77,54.56
AGND on Top Layer: 15.55,62.71 17.17,62.71 17.17,61.54 15.55,61.54
AGND on Bottom Layer: 15.55,67.13 25.15,67.13 25.15,61.54 15.55,61.54
AGND on Bottom Layer: 58.88,29.74 77.93,29.74 77.93,12.37 58.88,12.37
GND on Top Layer: -4.17,103 82.45,103 82.45,-4.5 -4.17,-4.5
GND on Top Layer: 30.93,64.29 35.36,64.29 35.36,62.18 30.93,62.18
GND on Top Layer: 35.88,61.85 39.8,61.85 39.8,60.41 35.88,60.41
GND on Bottom Layer: -2.69,100.51 84.68,100.51 84.68,-2.92 -2.69,-2.92
VCC+3.3V on Top Layer: 32.07,29.95 37.15,29.95 37.15,27.29 32.07,27.29
VCC+3.3V on Top Layer: 8.29,89.21 10.54,89.21 10.54,79.22 8.29,79.22
VCC+3.3V on Top Layer: 17.42,77.8 24.64,77.8 24.64,67.39 17.42,67.39
VCC+5V on Top Layer: 23.82,90.65 40.69,90.65 40.69,68.86 23.82,68.86
VCC+5V on Top Layer: 5.46,89.21 7.98,89.21 7.98,79.22 5.46,79.22
VCC+5V on Bottom Layer: 35,90.61 37.85,90.61 37.85,88.62 35,88.62
VCCA+3.3V on Top Layer: 15.64,67.03 18.81,67.03 18.81,62.97 15.64,62.97
USB+5V on Top Layer: 35.92,93.95 56.39,93.95 56.39,64.19 35.92,64.19
USB+5V on Top Layer: 11.43,94.55 12.45,94.55 12.45,91.36 11.43,91.36
USB+5V on Top Layer: 33.25,94.55 34.26,94.55 34.26,91.36 33.25,91.36
USB+5V on Top Layer: 16.23,94.55 17.25,94.55 17.25,91.36 16.23,91.36
USB+5V on Top Layer: 33.25,96.44 49.63,96.44 49.63,91.31 33.25,91.31
USB+5V on Top Layer: 28.45,94.55 29.46,94.55 29.46,91.36 28.45,91.36
USB+5V on Bottom Layer: 11.43,93.04 34.26,93.04 34.26,91.36 11.43,91.36
$1N3219 on Top Layer: 17.63,64.64 25.09,64.64 25.09,61.54 17.63,61.54
$2N858 on Top Layer: 46.18,97.31 66.85,97.31 66.85,83.44 46.18,83.44
$2N1125 on Top Layer: 38.61,87 52.58,87 52.58,79.07 38.61,79.07
$2N1439 on Top Layer: 50.39,78.87 60.2,78.87 60.2,70.84 50.39,70.84
$2N5030 on Top Layer: 37.39,93.73 47.26,93.73 47.26,91.06 37.39,91.06

Small or netless copper shapes (teardrops, artwork), in the pictures only: 604 on Top Layer, 160 on Bottom Layer

## Text on the board
Bottom Silkscreen Layer: 5V | 3V3 | SPI | IIC | SPI:PA15(CS)PB3(CLK)PB4(MOSI)PB5(MISO) | IIC:PB15(SCL)PB14(SDA)PB13PB12 | DAC: | PA4 PA5 | ADC: | PA0 PA1 | USART2:PA2(TX)PA3(RX) | USART3:PB10(TX)PB11(RX) | USART4:PC10(TX)PC11(RX) | 引脚分配
Top Silkscreen Layer: BOOT0 | BOOT1 | PC13 | PE13 | PE15 | PB11 | GND | PE11 | CLK | PA3 | PA5 | PA7 | PC3 | PC5 | PE3 | PE5 | PE7 | PE9 | PA1 | PC1 | DIO | PB1 | 5V | PB10 | PE14 | PE10 | PE12 | USART | PA4 | PC4 | PA0 | PA2 | PC0 | PC2 | PA6 | PE4 | PB0 | PB2 | PE2 | PE8 | PE6 | 3V3 | USB | PB7 | PD8 | PB6 | PA15 | PA13 | PD15 | PD13 | PB15 | PB13 | + | PA11 | PC11 | PD11 | PD4 | PA9 | PC7 | PC9 | PB5 | PB3 | PD2 | PD0 | PB9 | PD6 | PD9 | PE1 | - | PA14 | PA12 | PA10 | PC12 | PC10 | PD14 | PD12 | PD10 | PB12 | PA8 | PB4 | PC8 | PC6 | PB8 | PD7 | PD5 | PD3 | PE0 | PD1 | 3.3V | USART2 | USART4 | USART3 | RST | SWD | DAC | ADC
